# Altium project lightSoakV1.PrjPcb (part 1 of 2)
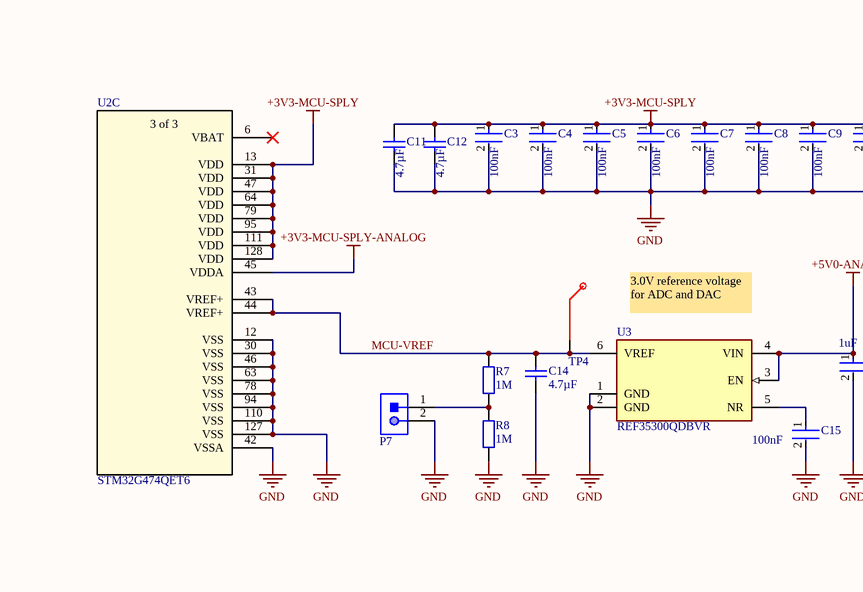
[diagram p0: V1_sch.SchDoc, top left]
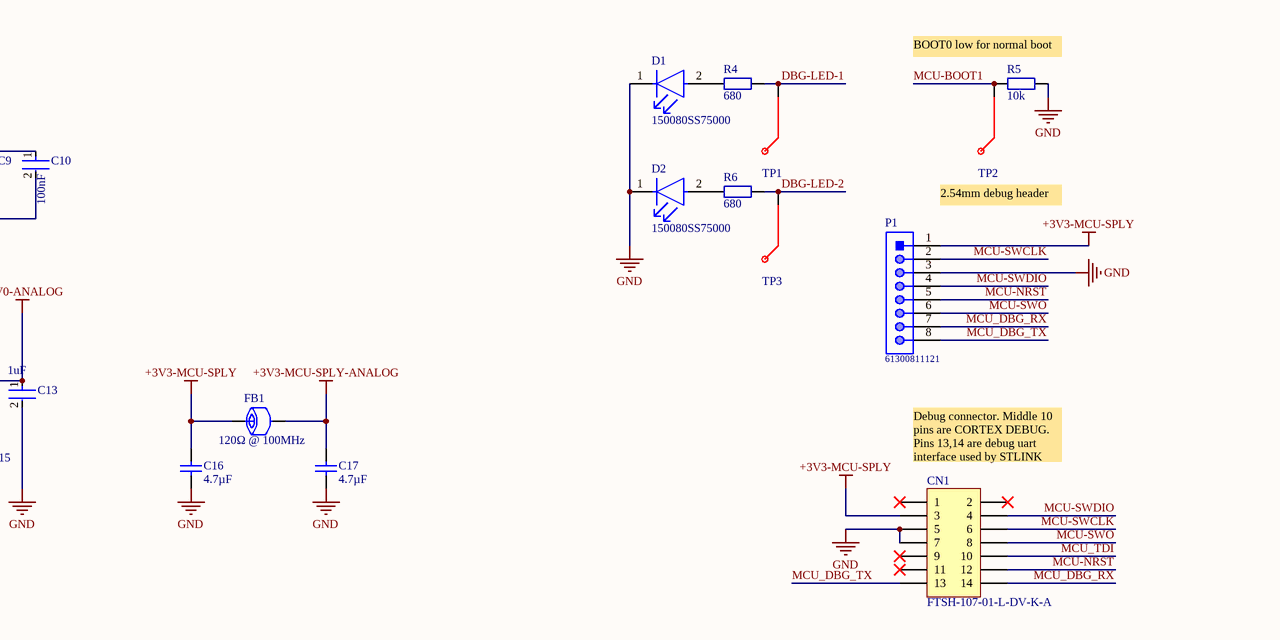
[diagram p1: V1_sch.SchDoc, top right]
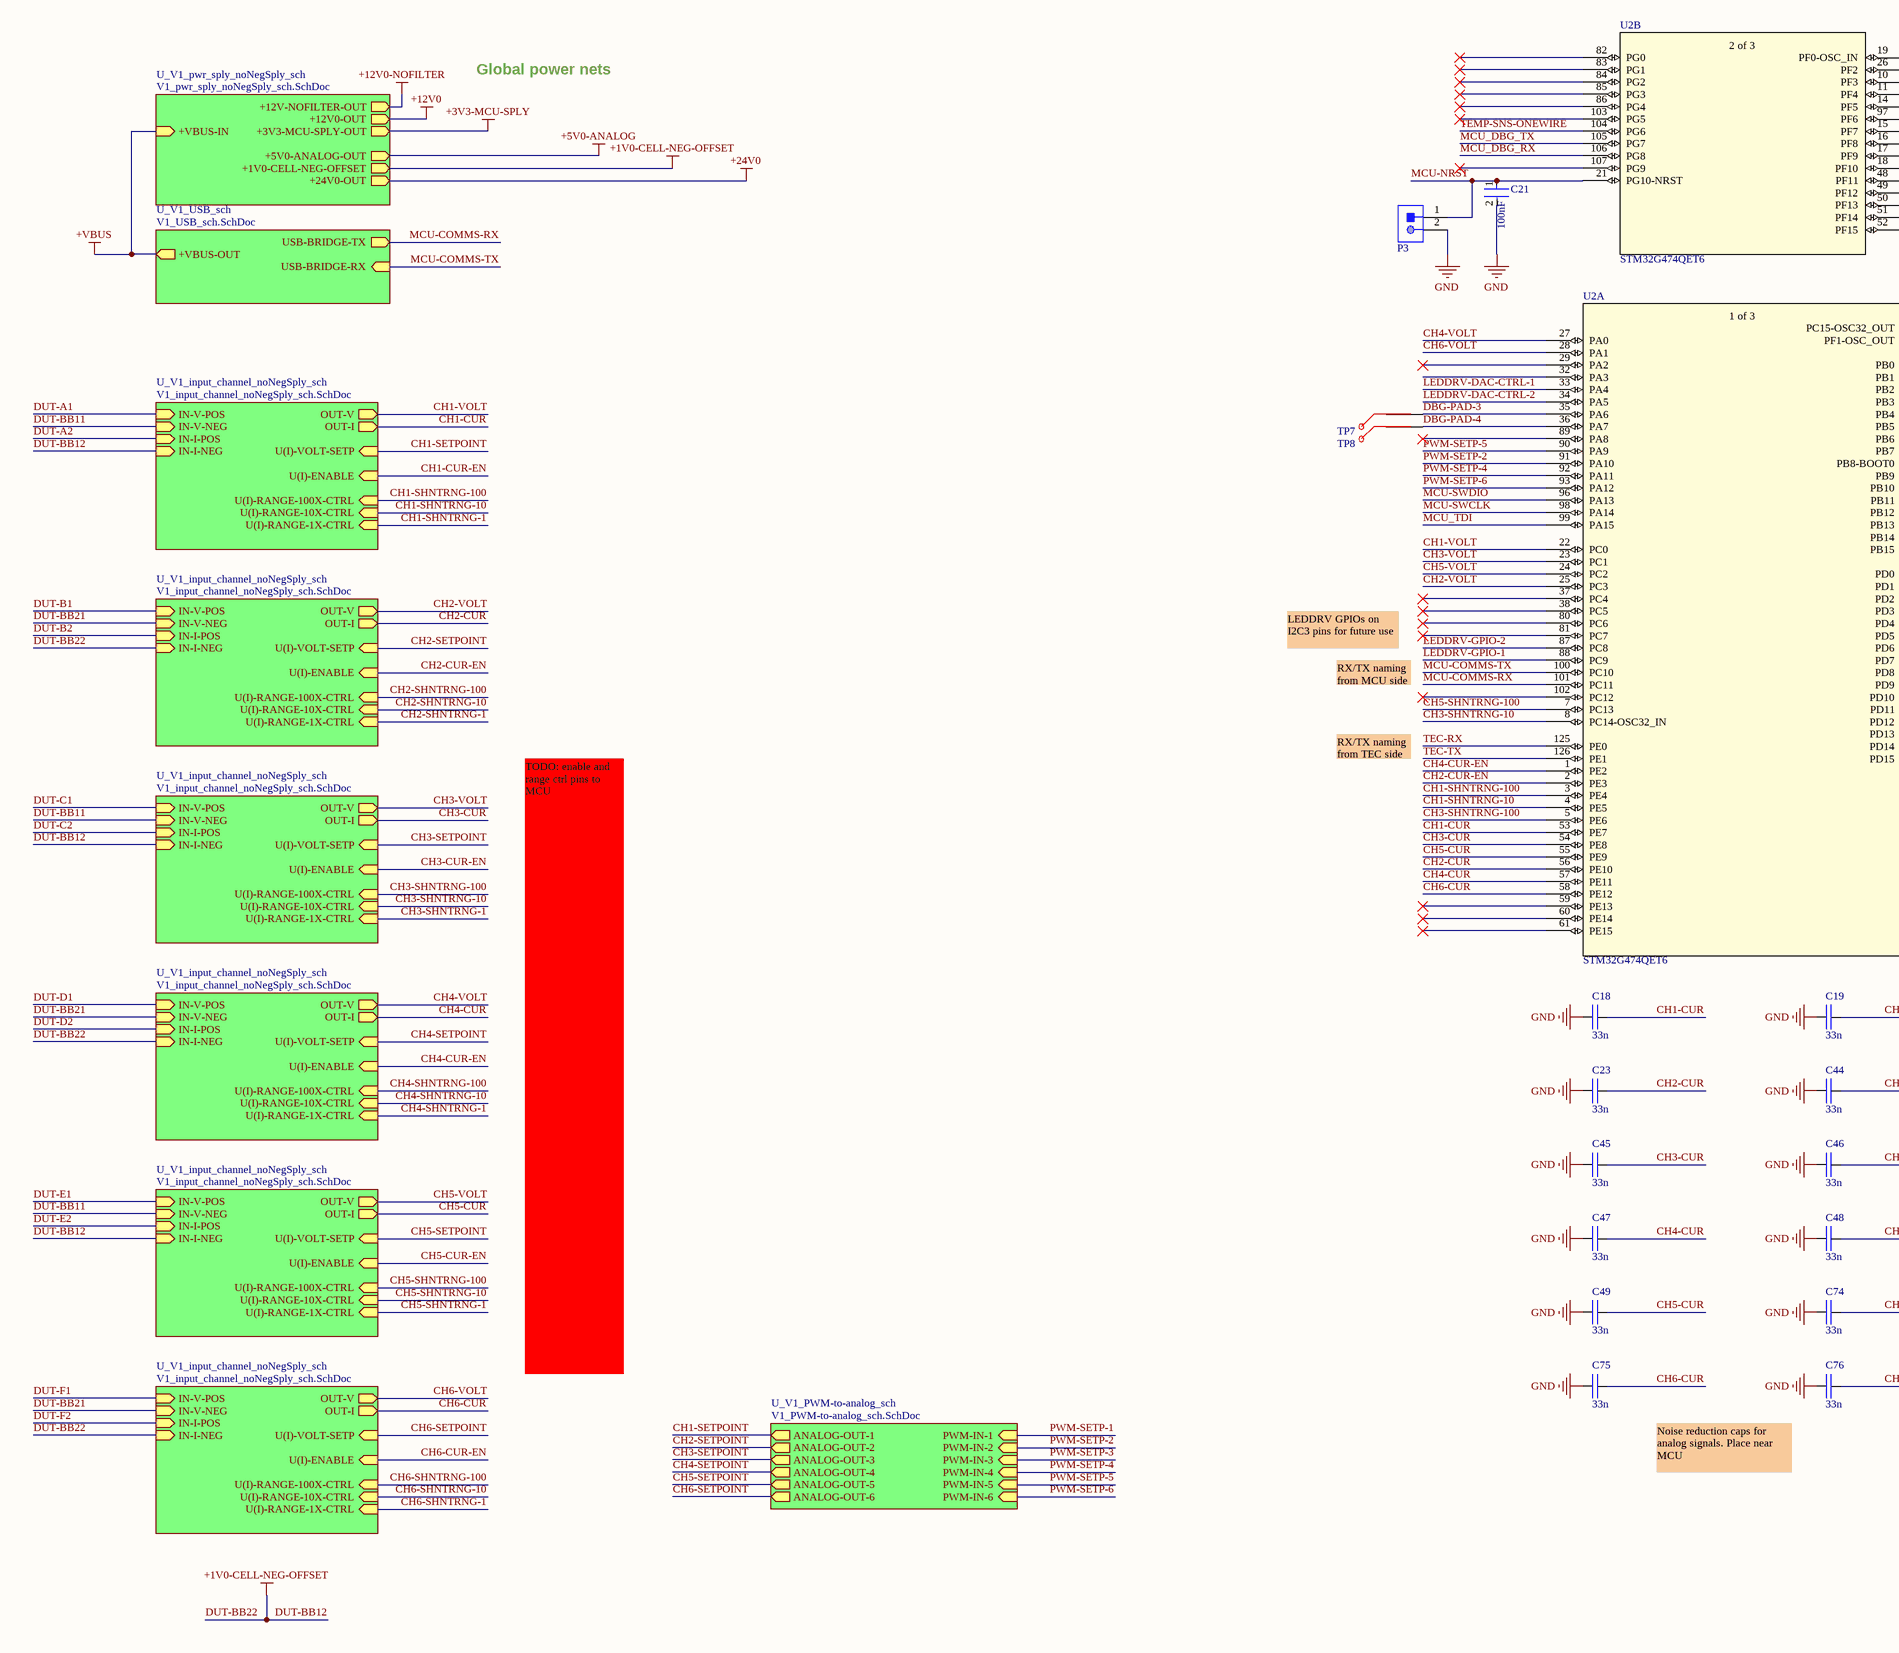
[diagram p2: V1_sch.SchDoc, bottom left]
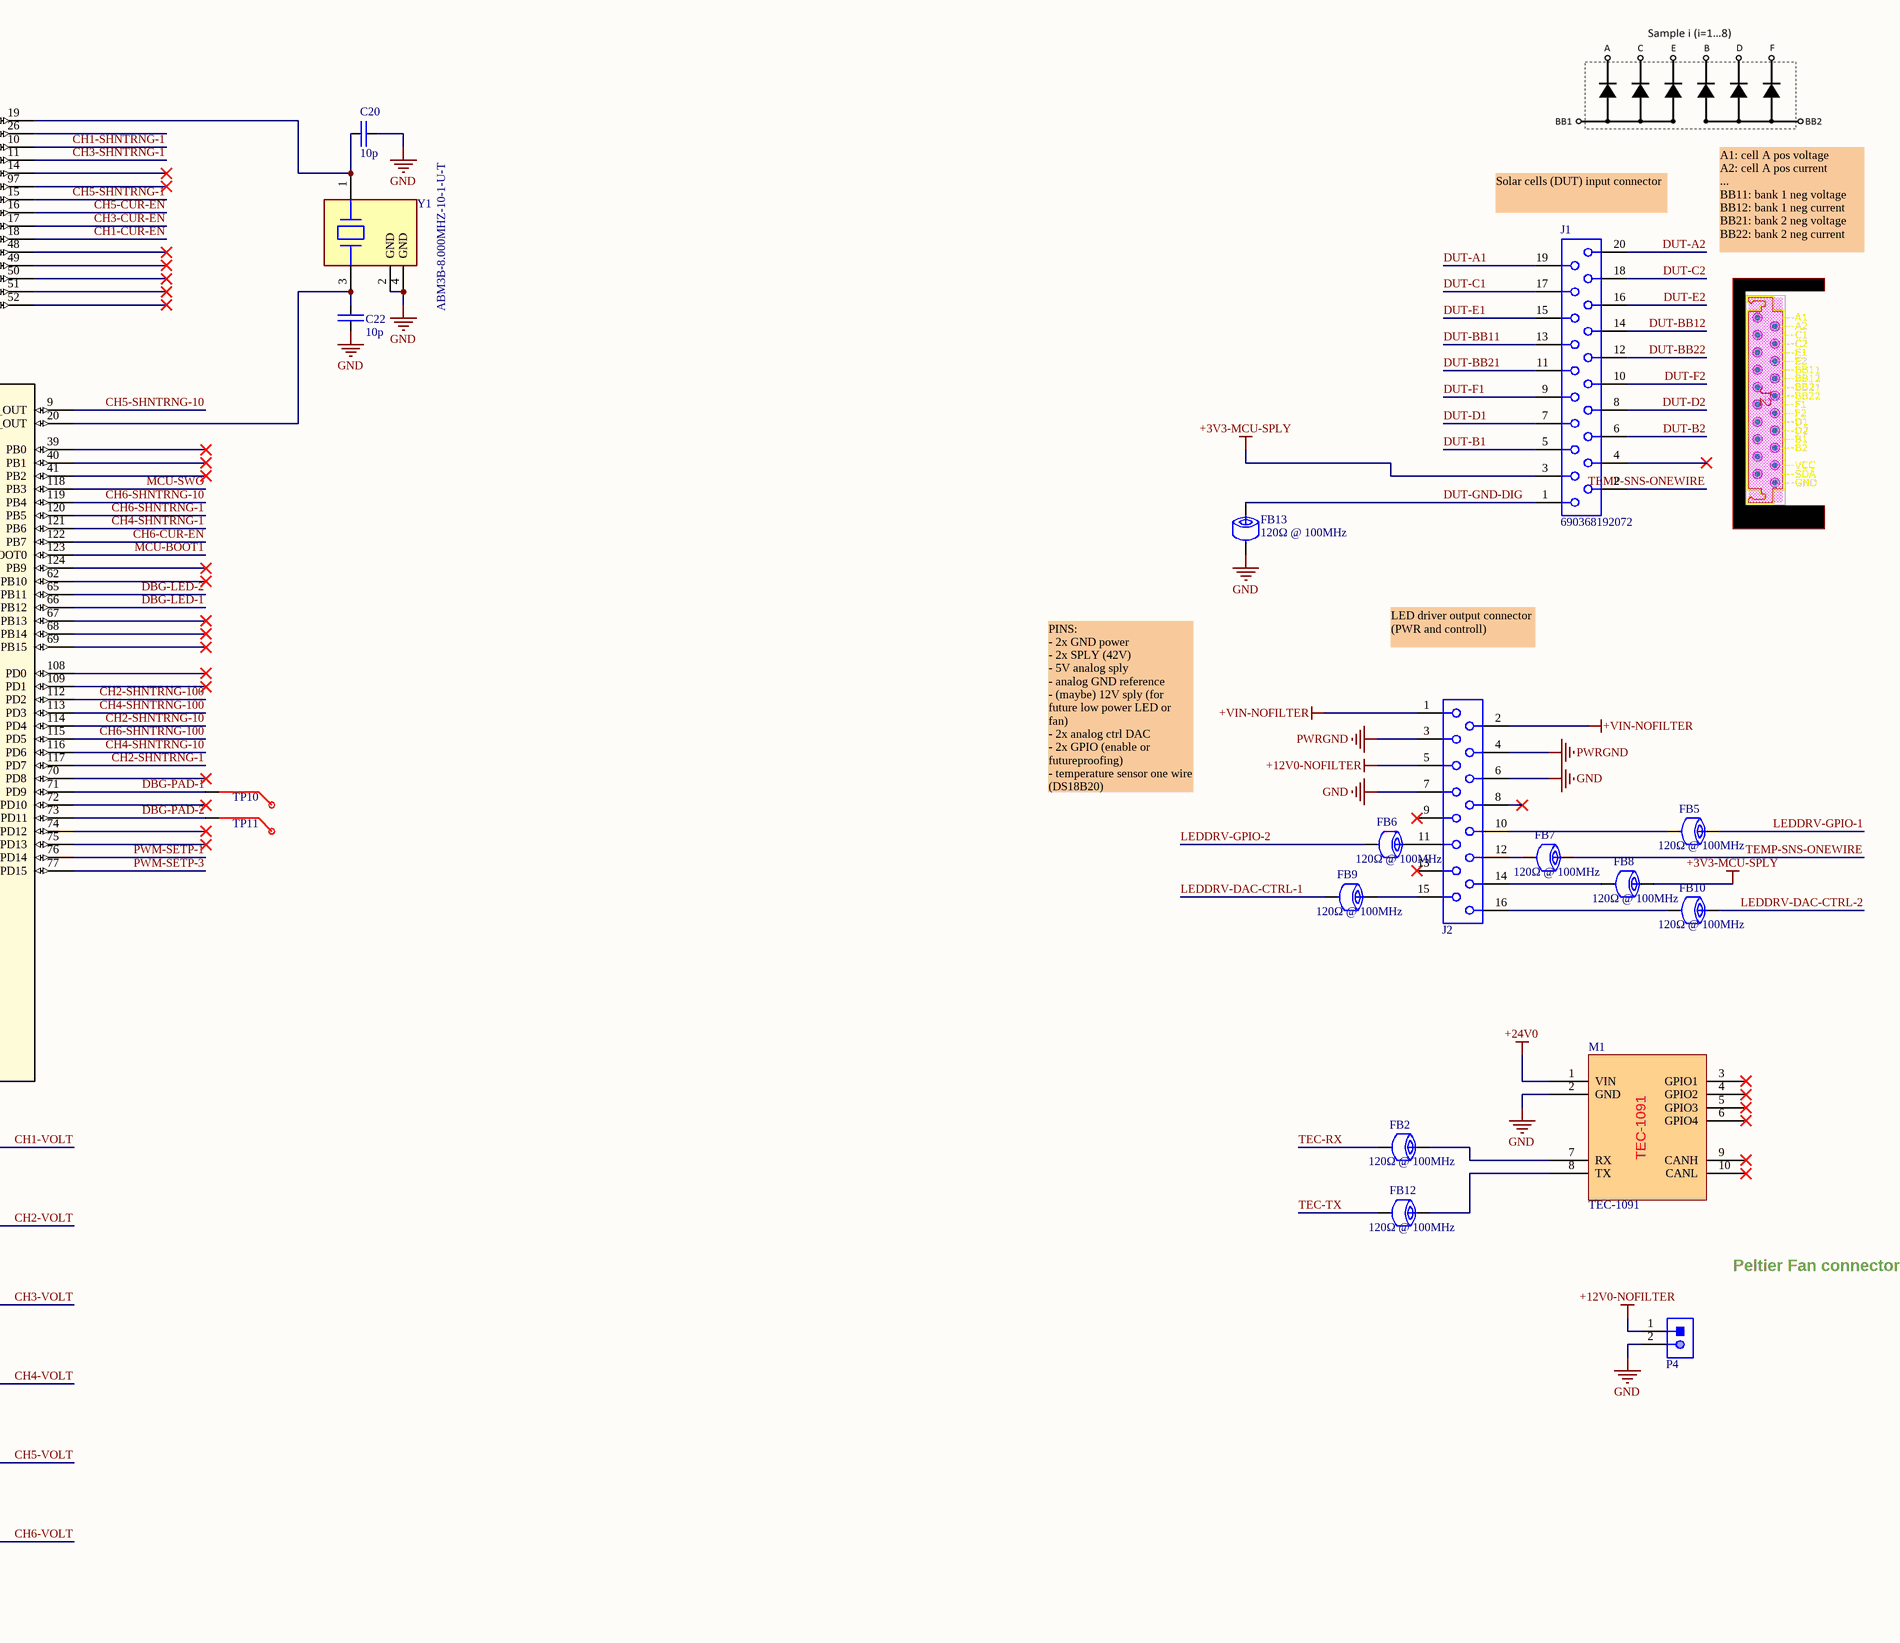
[diagram p3: V1_sch.SchDoc, bottom right]
5 sheets, 451 parts. Net scope: hierarchical (ports join the sheet entries above them; power ports are global).
Board file: V1_PCB-main.PcbDoc
Sheets:
  V1_sch.SchDoc
    U_V1_pwr_sply_noNegSply_sch = V1_pwr_sply_noNegSply_sch.SchDoc
    U_V1_USB_sch = V1_USB_sch.SchDoc
    U_V1_input_channel_noNegSply_sch = V1_input_channel_noNegSply_sch.SchDoc
    U_V1_input_channel_noNegSply_sch = V1_input_channel_noNegSply_sch.SchDoc
    U_V1_input_channel_noNegSply_sch = V1_input_channel_noNegSply_sch.SchDoc
    U_V1_input_channel_noNegSply_sch = V1_input_channel_noNegSply_sch.SchDoc
    U_V1_input_channel_noNegSply_sch = V1_input_channel_noNegSply_sch.SchDoc
    U_V1_input_channel_noNegSply_sch = V1_input_channel_noNegSply_sch.SchDoc
    U_V1_PWM-to-analog_sch = V1_PWM-to-analog_sch.SchDoc

## Sheet V1_sch.SchDoc
size A1; SheetNumber: 1; SheetTotal: 5; SPICEModelCacheQUSBBUGH: <root> / <DocumentId>QUSBBUGH</DocumentId> / <CacheFrame Number="0"> / <Model Name="0805_885012107018_4.7uf" Kind="CKT"> / <Text>******* / .subckt 0805_885012107018_4.7uF 1 2 / Rser 1 3 0.00349429730952 / Lser 2 4 2.52123218E-10 / C1 3 4 0.0000047 / Rpar 3 4 20000000 / .ends 0805_885012107018_4.7uF</Text> / </Model> / </CacheFrame> / </root>

### Parts
C3  Capacitance: 100nF  [FP-885012206095-IPC_B]  (hidden comment: 885012206095)
C4  Capacitance: 100nF  [FP-885012206095-IPC_B]  (hidden comment: 885012206095)
C5  Capacitance: 100nF  [FP-885012206095-IPC_B]  (hidden comment: 885012206095)
C6  Capacitance: 100nF  [FP-885012206095-IPC_B]  (hidden comment: 885012206095)
C7  Capacitance: 100nF  [FP-885012206095-IPC_B]  (hidden comment: 885012206095)
C8  Capacitance: 100nF  [FP-885012206095-IPC_B]  (hidden comment: 885012206095)
C9  Capacitance: 100nF  [FP-885012206095-IPC_B]  (hidden comment: 885012206095)
C10  Capacitance: 100nF  [FP-885012206095-IPC_B]  (hidden comment: 885012206095)
C11  Capacitance: 4.7µF  [WCAP-CSGP_0805_L2W1.25H1.25]  (hidden comment: 885012107018)
C12  Capacitance: 4.7µF  [WCAP-CSGP_0805_L2W1.25H1.25]  (hidden comment: 885012107018)
C13  Capacitance: 1uF  [FP-885012207078-IPC_B]  (hidden comment: 885012207078)
C14  Capacitance: 4.7µF  [WCAP-CSGP_0805_L2W1.25H1.25]  (hidden comment: 885012107018)
C15  Capacitance: 100nF  [FP-885012206095-IPC_B]  (hidden comment: 885012206095)
C16  Capacitance: 4.7µF  [WCAP-CSGP_0805_L2W1.25H1.25]  (hidden comment: 885012107018)
C17  Capacitance: 4.7µF  [WCAP-CSGP_0805_L2W1.25H1.25]  (hidden comment: 885012107018)
C18  value 33n  [FPR_0603_C_R0]  (hidden comment: PN_C0603_TBD)
C19  value 33n  [FPR_0603_C_R0]  (hidden comment: PN_C0603_TBD)
C20  value 10p  [FPR_0603_C_R0]  (hidden comment: PN_C0603_10p)
C21  Capacitance: 100nF  [FP-885012206095-IPC_B]  (hidden comment: 885012206095)
C22  value 10p  [FPR_0603_C_R0]  (hidden comment: PN_C0603_10p)
C23  value 33n  [FPR_0603_C_R0]  (hidden comment: PN_C0603_TBD)
C44  value 33n  [FPR_0603_C_R0]  (hidden comment: PN_C0603_TBD)
C45  value 33n  [FPR_0603_C_R0]  (hidden comment: PN_C0603_TBD)
C46  value 33n  [FPR_0603_C_R0]  (hidden comment: PN_C0603_TBD)
C47  value 33n  [FPR_0603_C_R0]  (hidden comment: PN_C0603_TBD)
C48  value 33n  [FPR_0603_C_R0]  (hidden comment: PN_C0603_TBD)
C49  value 33n  [FPR_0603_C_R0]  (hidden comment: PN_C0603_TBD)
C74  value 33n  [FPR_0603_C_R0]  (hidden comment: PN_C0603_TBD)
C75  value 33n  [FPR_0603_C_R0]  (hidden comment: PN_C0603_TBD)
C76  value 33n  [FPR_0603_C_R0]  (hidden comment: PN_C0603_TBD)
CN1  FTSH-107-01-L-DV-K-A  [CON_STDC14_Receiver_MEDIUM_WITH_MIPI10_3D]
D1  150080SS75000  [FP-150080SS75000-MFG]
D2  150080SS75000  [FP-150080SS75000-MFG]
FB1  120Ω @ 100MHz  [SMD_0805]
FB2  120Ω @ 100MHz  [SMD_0805]
FB5  120Ω @ 100MHz  [SMD_0805]
FB6  120Ω @ 100MHz  [SMD_0805]
FB7  120Ω @ 100MHz  [SMD_0805]
FB8  120Ω @ 100MHz  [SMD_0805]
FB9  120Ω @ 100MHz  [SMD_0805]
FB10  120Ω @ 100MHz  [SMD_0805]
FB12  120Ω @ 100MHz  [SMD_0805]
FB13  120Ω @ 100MHz  [SMD_0805]
J1  690368192072  [690368192072]
J2  690368191672  [690368191672]  (value not drawn)
M1  TEC-1091  [tec1091-pins]
P1  61300811121  [61300811121]
P3  61300211121  [61300211121]  (value not drawn)
P4  61300211121  [61300211121]  (value not drawn)
P7  61300211121  [61300211121]  (value not drawn)
R4  value 680  [FPR_0603_R_R0]  (hidden comment: PN_R0603_680R)
R5  value 10k  [FPR_0603_R_R0]  (hidden comment: PN_R0603_10k)
R6  value 680  [FPR_0603_R_R0]  (hidden comment: PN_R0603_680R)
R7  value 1M  [FPR_0603_R_R0]  (hidden comment: PN_R0603_1M)
R8  value 1M  [FPR_0603_R_R0]  (hidden comment: PN_R0603_1M)
TP1  Test Point  [Test Point 1.5mm SMD]  (value not drawn)
TP2  Test Point  [Test Point 1.5mm SMD]  (value not drawn)
TP3  Test Point  [Test Point 1.5mm SMD]  (value not drawn)
TP4  Test Point  [Test Point 1.5mm SMD]  (value not drawn)
TP7  Test Point  [Test Point 1.5mm SMD]  (value not drawn)
TP8  Test Point  [Test Point 1.5mm SMD]  (value not drawn)
TP10  Test Point  [Test Point 1.5mm SMD]  (value not drawn)
TP11  Test Point  [Test Point 1.5mm SMD]  (value not drawn)
U2  STM32G474QET6  [LPQFP-128]  (parts A,B,C of 3)
U3  REF35300QDBVR  [FP-DBV0006A-MFG]
Y1  ABM3B-8.000MHZ-10-1-U-T  [FP-ABM3B-MFG]

### Sub-sheets
U_V1_input_channel_noNegSply_sch = V1_input_channel_noNegSply_sch.SchDoc: OUT-V (out), IN-V-POS (in), IN-V-NEG (in), IN-I-POS (in), U(I)-ENABLE (in), U(I)-VOLT-SETP (in), U(I)-RANGE-100X-CTRL (in), U(I)-RANGE-10X-CTRL (in), U(I)-RANGE-1X-CTRL (in), OUT-I (out), IN-I-NEG (in)
U_V1_input_channel_noNegSply_sch = V1_input_channel_noNegSply_sch.SchDoc: OUT-V (out), IN-V-POS (in), IN-V-NEG (in), IN-I-NEG (in), IN-I-POS (in), U(I)-ENABLE (in), U(I)-VOLT-SETP (in), U(I)-RANGE-100X-CTRL (in), U(I)-RANGE-10X-CTRL (in), U(I)-RANGE-1X-CTRL (in), OUT-I (out)
U_V1_input_channel_noNegSply_sch = V1_input_channel_noNegSply_sch.SchDoc: OUT-V (out), IN-V-POS (in), IN-V-NEG (in), IN-I-NEG (in), IN-I-POS (in), U(I)-ENABLE (in), U(I)-VOLT-SETP (in), U(I)-RANGE-100X-CTRL (in), U(I)-RANGE-10X-CTRL (in), U(I)-RANGE-1X-CTRL (in), OUT-I (out)
U_V1_input_channel_noNegSply_sch = V1_input_channel_noNegSply_sch.SchDoc: OUT-V (out), IN-V-POS (in), IN-V-NEG (in), IN-I-NEG (in), IN-I-POS (in), U(I)-ENABLE (in), U(I)-VOLT-SETP (in), U(I)-RANGE-100X-CTRL (in), U(I)-RANGE-10X-CTRL (in), U(I)-RANGE-1X-CTRL (in), OUT-I (out)
U_V1_input_channel_noNegSply_sch = V1_input_channel_noNegSply_sch.SchDoc: OUT-V (out), IN-V-POS (in), IN-V-NEG (in), IN-I-NEG (in), IN-I-POS (in), U(I)-ENABLE (in), U(I)-VOLT-SETP (in), U(I)-RANGE-100X-CTRL (in), U(I)-RANGE-10X-CTRL (in), U(I)-RANGE-1X-CTRL (in), OUT-I (out)
U_V1_input_channel_noNegSply_sch = V1_input_channel_noNegSply_sch.SchDoc: OUT-V (out), IN-V-POS (in), IN-V-NEG (in), IN-I-NEG (in), IN-I-POS (in), U(I)-ENABLE (in), U(I)-VOLT-SETP (in), U(I)-RANGE-100X-CTRL (in), U(I)-RANGE-10X-CTRL (in), U(I)-RANGE-1X-CTRL (in), OUT-I (out)
U_V1_PWM-to-analog_sch = V1_PWM-to-analog_sch.SchDoc: PWM-IN-1 (in), PWM-IN-2 (in), PWM-IN-3 (in), PWM-IN-4 (in), PWM-IN-5 (in), PWM-IN-6 (in), ANALOG-OUT-1 (out), ANALOG-OUT-2 (out), ANALOG-OUT-3 (out), ANALOG-OUT-4 (out), ANALOG-OUT-5 (out), ANALOG-OUT-6 (out)
U_V1_pwr_sply_noNegSply_sch = V1_pwr_sply_noNegSply_sch.SchDoc: +12V-NOFILTER-OUT (out), +12V0-OUT (out), +3V3-MCU-SPLY-OUT (out), +5V0-ANALOG-OUT (out), +VBUS-IN (in), +1V0-CELL-NEG-OFFSET (out), +24V0-OUT (out)
U_V1_USB_sch = V1_USB_sch.SchDoc: USB-BRIDGE-TX (out), USB-BRIDGE-RX (in), +VBUS-OUT (out)

### Nets
+3V3-MCU-SPLY: C3.1 C4.1 C5.1 C6.1 C7.1 C8.1 C9.1 C10.1 C11.2 C12.2 C16.2 CN1.3 FB1.1 FB8.1 J1.3 P1.1 U2.13(VDD) U2.31(VDD) U2.47(VDD) U2.64(VDD) U2.79(VDD) U2.95(VDD) U2.111(VDD) U2.128(VDD) ; sheet U_V1_pwr_sply_noNegSply_sch/+3V3-MCU-SPLY-OUT
+3V3-MCU-SPLY-ANALOG: C17.2 FB1.2 U2.45(VDDA)
+5V0-ANALOG: C13.1 U3.3(EN) U3.4(VIN) ; sheet U_V1_pwr_sply_noNegSply_sch/+5V0-ANALOG-OUT
+12V0-NOFILTER: J2.5 P4.1 ; sheet U_V1_pwr_sply_noNegSply_sch/+12V-NOFILTER-OUT  [project net +12V-NOFILTER]
+24V0: M1.1(VIN) ; sheet U_V1_pwr_sply_noNegSply_sch/+24V0-OUT
+VBUS: sheet U_V1_pwr_sply_noNegSply_sch/+VBUS-IN, sheet U_V1_USB_sch/+VBUS-OUT
+VIN-NOFILTER: J2.1 J2.2
DUT-BB12: J1.12 J1.14 ; sheet U_V1_pwr_sply_noNegSply_sch/+1V0-CELL-NEG-OFFSET, sheet U_V1_input_channel_noNegSply_sch/IN-I-NEG, sheet U_V1_input_channel_noNegSply_sch/IN-I-NEG, sheet U_V1_input_channel_noNegSply_sch/IN-I-NEG, sheet U_V1_input_channel_noNegSply_sch/IN-I-NEG, sheet U_V1_input_channel_noNegSply_sch/IN-I-NEG, sheet U_V1_input_channel_noNegSply_sch/IN-I-NEG  [also labelled +1V0-CELL-NEG-OFFSET, DUT-BB22]
GND: C3.2 C4.2 C5.2 C6.2 C7.2 C8.2 C9.2 C10.2 C11.1 C12.1 C13.2 C14.1 C15.2 C16.1 C17.1 C18.2 C19.2 C20.2 C21.2 C22.2 C23.2 C44.2 C45.2 C46.2 C47.2 C48.2 C49.2 C74.2 C75.2 C76.2 CN1.5 CN1.7 D1.1(C) D2.1(C) FB13.2 J2.6 J2.7 M1.2(GND) P1.3 P3.2 P4.2 P7.2 R5.1 R8.2 U2.12(VSS) U2.30(VSS) U2.42(VSSA) U2.46(VSS) U2.63(VSS) U2.78(VSS) U2.94(VSS) U2.110(VSS) U2.127(VSS) U3.1(GND) U3.2(GND) Y1.2(GND) Y1.4(GND)
PWRGND: J2.3 J2.4
CH1-CUR: C18.1 U2.53(PE7) ; sheet U_V1_input_channel_noNegSply_sch/OUT-I
CH1-CUR-EN: U2.18(PF10) ; sheet U_V1_input_channel_noNegSply_sch/U(I)-ENABLE
CH1-SETPOINT: sheet U_V1_input_channel_noNegSply_sch/U(I)-VOLT-SETP, sheet U_V1_PWM-to-analog_sch/ANALOG-OUT-1
CH1-SHNTRNG-1: U2.10(PF3) ; sheet U_V1_input_channel_noNegSply_sch/U(I)-RANGE-1X-CTRL
CH1-SHNTRNG-10: U2.4(PE5) ; sheet U_V1_input_channel_noNegSply_sch/U(I)-RANGE-10X-CTRL
CH1-SHNTRNG-100: U2.3(PE4) ; sheet U_V1_input_channel_noNegSply_sch/U(I)-RANGE-100X-CTRL
CH1-VOLT: C19.1 U2.22(PC0) ; sheet U_V1_input_channel_noNegSply_sch/OUT-V
CH2-CUR: C23.1 U2.56(PE10) ; sheet U_V1_input_channel_noNegSply_sch/OUT-I
CH2-CUR-EN: U2.2(PE3) ; sheet U_V1_input_channel_noNegSply_sch/U(I)-ENABLE
CH2-SETPOINT: sheet U_V1_input_channel_noNegSply_sch/U(I)-VOLT-SETP, sheet U_V1_PWM-to-analog_sch/ANALOG-OUT-2
CH2-SHNTRNG-1: U2.117(PD7) ; sheet U_V1_input_channel_noNegSply_sch/U(I)-RANGE-1X-CTRL
CH2-SHNTRNG-10: U2.114(PD4) ; sheet U_V1_input_channel_noNegSply_sch/U(I)-RANGE-10X-CTRL
CH2-SHNTRNG-100: U2.112(PD2) ; sheet U_V1_input_channel_noNegSply_sch/U(I)-RANGE-100X-CTRL
CH2-VOLT: C44.1 U2.25(PC3) ; sheet U_V1_input_channel_noNegSply_sch/OUT-V
CH3-CUR: C45.1 U2.54(PE8) ; sheet U_V1_input_channel_noNegSply_sch/OUT-I
CH3-CUR-EN: U2.17(PF9) ; sheet U_V1_input_channel_noNegSply_sch/U(I)-ENABLE
CH3-SETPOINT: sheet U_V1_input_channel_noNegSply_sch/U(I)-VOLT-SETP, sheet U_V1_PWM-to-analog_sch/ANALOG-OUT-3
CH3-SHNTRNG-1: U2.11(PF4) ; sheet U_V1_input_channel_noNegSply_sch/U(I)-RANGE-1X-CTRL
CH3-SHNTRNG-10: U2.8(PC14-OSC32_IN) ; sheet U_V1_input_channel_noNegSply_sch/U(I)-RANGE-10X-CTRL
CH3-SHNTRNG-100: U2.5(PE6) ; sheet U_V1_input_channel_noNegSply_sch/U(I)-RANGE-100X-CTRL
CH3-VOLT: C46.1 U2.23(PC1) ; sheet U_V1_input_channel_noNegSply_sch/OUT-V
CH4-CUR: C47.1 U2.57(PE11) ; sheet U_V1_input_channel_noNegSply_sch/OUT-I
CH4-CUR-EN: U2.1(PE2) ; sheet U_V1_input_channel_noNegSply_sch/U(I)-ENABLE
CH4-SETPOINT: sheet U_V1_input_channel_noNegSply_sch/U(I)-VOLT-SETP, sheet U_V1_PWM-to-analog_sch/ANALOG-OUT-4
CH4-SHNTRNG-1: U2.121(PB6) ; sheet U_V1_input_channel_noNegSply_sch/U(I)-RANGE-1X-CTRL
CH4-SHNTRNG-10: U2.116(PD6) ; sheet U_V1_input_channel_noNegSply_sch/U(I)-RANGE-10X-CTRL
CH4-SHNTRNG-100: U2.113(PD3) ; sheet U_V1_input_channel_noNegSply_sch/U(I)-RANGE-100X-CTRL
CH4-VOLT: C48.1 U2.27(PA0) ; sheet U_V1_input_channel_noNegSply_sch/OUT-V
CH5-CUR: C49.1 U2.55(PE9) ; sheet U_V1_input_channel_noNegSply_sch/OUT-I
CH5-CUR-EN: U2.16(PF8) ; sheet U_V1_input_channel_noNegSply_sch/U(I)-ENABLE
CH5-SETPOINT: sheet U_V1_input_channel_noNegSply_sch/U(I)-VOLT-SETP, sheet U_V1_PWM-to-analog_sch/ANALOG-OUT-5
CH5-SHNTRNG-1: U2.15(PF7) ; sheet U_V1_input_channel_noNegSply_sch/U(I)-RANGE-1X-CTRL
CH5-SHNTRNG-10: U2.9(PC15-OSC32_OUT) ; sheet U_V1_input_channel_noNegSply_sch/U(I)-RANGE-10X-CTRL
CH5-SHNTRNG-100: U2.7(PC13) ; sheet U_V1_input_channel_noNegSply_sch/U(I)-RANGE-100X-CTRL
CH5-VOLT: C74.1 U2.24(PC2) ; sheet U_V1_input_channel_noNegSply_sch/OUT-V
CH6-CUR: C75.1 U2.58(PE12) ; sheet U_V1_input_channel_noNegSply_sch/OUT-I
CH6-CUR-EN: U2.122(PB7) ; sheet U_V1_input_channel_noNegSply_sch/U(I)-ENABLE
CH6-SETPOINT: sheet U_V1_input_channel_noNegSply_sch/U(I)-VOLT-SETP, sheet U_V1_PWM-to-analog_sch/ANALOG-OUT-6
CH6-SHNTRNG-1: U2.120(PB5) ; sheet U_V1_input_channel_noNegSply_sch/U(I)-RANGE-1X-CTRL
CH6-SHNTRNG-10: U2.119(PB4) ; sheet U_V1_input_channel_noNegSply_sch/U(I)-RANGE-10X-CTRL
CH6-SHNTRNG-100: U2.115(PD5) ; sheet U_V1_input_channel_noNegSply_sch/U(I)-RANGE-100X-CTRL
CH6-VOLT: C76.1 U2.28(PA1) ; sheet U_V1_input_channel_noNegSply_sch/OUT-V
DBG-LED-1: R4.1 TP1.1 U2.66(PB12)
DBG-LED-2: R6.1 TP3.1 U2.65(PB11)
DBG-PAD-1: TP10.1 U2.71(PD9)
DBG-PAD-2: TP11.1 U2.73(PD11)
DBG-PAD-3: TP7.1 U2.35(PA6)
DBG-PAD-4: TP8.1 U2.36(PA7)
DUT-A1: J1.19 ; sheet U_V1_input_channel_noNegSply_sch/IN-V-POS
DUT-A2: J1.20 ; sheet U_V1_input_channel_noNegSply_sch/IN-I-POS
DUT-B1: J1.5 ; sheet U_V1_input_channel_noNegSply_sch/IN-V-POS
DUT-B2: J1.6 ; sheet U_V1_input_channel_noNegSply_sch/IN-I-POS
DUT-BB11: J1.13 ; sheet U_V1_input_channel_noNegSply_sch/IN-V-NEG, sheet U_V1_input_channel_noNegSply_sch/IN-V-NEG, sheet U_V1_input_channel_noNegSply_sch/IN-V-NEG
DUT-BB21: J1.11 ; sheet U_V1_input_channel_noNegSply_sch/IN-V-NEG, sheet U_V1_input_channel_noNegSply_sch/IN-V-NEG, sheet U_V1_input_channel_noNegSply_sch/IN-V-NEG
DUT-C1: J1.17 ; sheet U_V1_input_channel_noNegSply_sch/IN-V-POS
DUT-C2: J1.18 ; sheet U_V1_input_channel_noNegSply_sch/IN-I-POS
DUT-D1: J1.7 ; sheet U_V1_input_channel_noNegSply_sch/IN-V-POS
DUT-D2: J1.8 ; sheet U_V1_input_channel_noNegSply_sch/IN-I-POS
DUT-E1: J1.15 ; sheet U_V1_input_channel_noNegSply_sch/IN-V-POS
DUT-E2: J1.16 ; sheet U_V1_input_channel_noNegSply_sch/IN-I-POS
DUT-F1: J1.9 ; sheet U_V1_input_channel_noNegSply_sch/IN-V-POS
DUT-F2: J1.10 ; sheet U_V1_input_channel_noNegSply_sch/IN-I-POS
DUT-GND-DIG: FB13.1 J1.1
LEDDRV-DAC-CTRL-1: FB9.2 U2.33(PA4)
LEDDRV-DAC-CTRL-2: FB10.1 U2.34(PA5)
LEDDRV-GPIO-1: FB5.1 U2.88(PC9)
LEDDRV-GPIO-2: FB6.2 U2.87(PC8)
MCU-BOOT1: R5.2 TP2.1 U2.123(PB8-BOOT0)
MCU-COMMS-RX: U2.101(PC11) ; sheet U_V1_USB_sch/USB-BRIDGE-TX
MCU-COMMS-TX: U2.100(PC10) ; sheet U_V1_USB_sch/USB-BRIDGE-RX
MCU-NRST: C21.1 CN1.12 P1.5 P3.1 U2.21(PG10-NRST)
MCU-SWCLK: CN1.6 P1.2 U2.98(PA14)
MCU-SWDIO: CN1.4 P1.4 U2.96(PA13)
MCU-SWO: CN1.8 P1.6 U2.118(PB3)
MCU-VREF: C14.2 R7.1 TP4.1 U2.43(VREF+) U2.44(VREF+) U3.6(VREF)
MCU_DBG_RX: CN1.14 P1.7 U2.106(PG8)
MCU_DBG_TX: CN1.13 P1.8 U2.105(PG7)
MCU_TDI: CN1.10 U2.99(PA15)
PWM-SETP-1: U2.76(PD14) ; sheet U_V1_PWM-to-analog_sch/PWM-IN-1
PWM-SETP-2: U2.91(PA10) ; sheet U_V1_PWM-to-analog_sch/PWM-IN-2
PWM-SETP-3: U2.77(PD15) ; sheet U_V1_PWM-to-analog_sch/PWM-IN-3
PWM-SETP-4: U2.92(PA11) ; sheet U_V1_PWM-to-analog_sch/PWM-IN-4
PWM-SETP-5: U2.90(PA9) ; sheet U_V1_PWM-to-analog_sch/PWM-IN-5
PWM-SETP-6: U2.93(PA12) ; sheet U_V1_PWM-to-analog_sch/PWM-IN-6
TEC-RX: FB2.2 U2.125(PE0)
TEC-TX: FB12.2 U2.126(PE1)
TEMP-SNS-ONEWIRE: FB7.1 J1.2 U2.104(PG6)
NetC15_1: C15.1 U3.5(NR)
NetC20_1: C20.1 U2.19(PF0-OSC_IN) Y1.1
NetC22_1: C22.1 U2.20(PF1-OSC_OUT) Y1.3
NetD1_2: D1.2(A) R4.2
NetD2_2: D2.2(A) R6.2
NetFB2_1: FB2.1 M1.7(RX)
NetFB5_2: FB5.2 J2.10
NetFB6_1: FB6.1 J2.11
NetFB7_2: FB7.2 J2.12
NetFB8_2: FB8.2 J2.14
NetFB9_1: FB9.1 J2.15
NetFB10_2: FB10.2 J2.16
NetFB12_1: FB12.1 M1.8(TX)
NetP7_1: P7.1 R7.2 R8.1

Not connected (* = marked no-connect by the designer): CN1 1* 2* 9* 11*; J1 4*; J2 8* 9* 13*; M1 3(GPIO1)* 4(GPIO2)* 5(GPIO3)* 6(GPIO4)* 9(CANH)* 10(CANL)*; U2 6(VBAT)* 14(PF5)* 26(PF2) 29(PA2)* 32(PA3) 37(PC4)* 38(PC5)* 39(PB0)* 40(PB1)* 41(PB2)* 48(PF11)* 49(PF12)* 50(PF13)* 51(PF14)* 52(PF15)* 59(PE13)* 60(PE14)* 61(PE15)* 62(PB10)* 67(PB13)* 68(PB14)* 69(PB15)* 70(PD8)* 72(PD10)* 74(PD12)* 75(PD13)* 80(PC6)* 81(PC7)* 82(PG0)* 83(PG1)* 84(PG2)* 85(PG3)* 86(PG4)* 89(PA8)* 97(PF6)* 102(PC12)* 103(PG5)* 107(PG9)* 108(PD0)* 109(PD1)* 124(PB9)*

### Notes on the sheet
- (near R5) BOOT0 low for normal boot
- 2.54mm debug header
- 3.0V reference voltage for ADC and DAC
- (near CN1) Debug connector. Middle 10 pins are CORTEX DEBUG. Pins 13,14 are debug uart interface used by STLINK devices.
- Global power nets
- (near J1) Solar cells (DUT) input connector
- A1: cell A pos voltage
  A2: cell A pos current
  ...
  BB11: bank 1 neg voltage
  BB12: bank 1 neg current
  BB21: bank 2 neg voltage
  BB22: bank 2 neg current
- LED driver output connector (PWR and controll)
- LEDDRV GPIOs on I2C3 pins for future use
- RX/TX naming from MCU side
- PINS:
  - 2x GND power
  - 2x SPLY (42V)
  - 5V analog sply
  - analog GND reference
  - (maybe) 12V sply (for future low power LED or fan)
  - 2x analog ctrl DAC
  - 2x GPIO (enable or futureproofing)
  - temperature sensor one wire (DS18B20)
- RX/TX naming from TEC side
- Peltier Fan connector
- TODO: enable and range ctrl pins to MCU
- Noise reduction caps for analog signals. Place near MCU
- (in symbol STM32G474QET6, part A) 1 of 3
- (in symbol STM32G474QET6, part B) 2 of 3
- (in symbol STM32G474QET6, part C) 3 of 3

### Library data of the parts
C3-C10 C15 C21 = CMP-207839-000004-1: CAP CER 0.1UF 50V X7R 0603; Tolerance: 10%; RoHS Compliant: Yes; Thickness: 0.037inch; Voltage Rating: 50V; Packaging: Cut Tape; Dielectric: X7R; Series: WCAP-CSGP; Width: 0.031inch; Max Operating Temperature: 125°C; Min Operating Temperature: -55°C; Case/Package: 0603; Case Code (Metric): 1608; Case Code (Imperial): 0603; Length: 0.063inch; Mount: Surface Mount; Voltage Rating (DC): 50V
C11 C12 C14 C16 C17 = 885012107018: WCAP-CSGP Multilayer Ceramic Chip Capacitor, General Purpose, size 0805, X5R, 4.7µF, 25VDC; Manufacturer: Wurth Elektronik; Case/Size Code: 0805; Capacitance Tolerance: +/-20%; Dissipation Factor: 10%; Insulation Resistance: 0.02GΩ; Rated Voltage (DC): 25V; Technical Reference: X5R0805475M025DFCT10000; Manufacturer Part Number: 885012107018; Category: Multilayer Ceramic Chip Capacitors; Match Code: WCAP-CSGP; ComponentLink1Description: Website Link; ComponentLink1URL: https://www.we-online.com/redexpert/article/885012107018?ad; ComponentLink2Description: Datasheet Link; ComponentLink2URL: https://www.we-online.com/redexpert/spec/885012107018?ad; Mount: Surface Mount; Operating Temperature Max: 85°C; Operating Temperature Min: -55°C; Packaging: Tape and Reel; Length: 2mm; Width: 1.25mm; Height: 1.25mm; Ceramic Type: X5R
C13 = CMP-207839-000010-1: CAP CER 1UF 25V X7R 0805; Tolerance: 10%; Series: WCAP-CSGP; Mount: Surface Mount; RoHS Compliant: Yes; Case Code (Metric): 2012; Width: 0.049inch; Thickness: 0.053inch; Dielectric: X7R; Max Operating Temperature: 125°C; Case Code (Imperial): 0805; Case/Package: 0805; Length: 0.079inch; Voltage Rating: 25V; Packaging: Cut Tape; Min Operating Temperature: -55°C; Voltage Rating (DC): 25V
C18-C20 C22 C23 C44-C49 C74-C76 = C: Capacitor - generic SMD
CN1 = FTSH-107-01-L-DV-K-A: Header 7x2, 1.27mm, Dual row, Straight, Surface mount, vertical male connector. 3.05mm lead. Mates with FFSD connector. Footprint compatible with FTSH-107-01-L-DV,-K,-A,-P,-ES (STDC14 MEDIUM)
D1 D2 = CMP-1426-00010-2: LED RED CLEAR 0805 SMD; Forward Voltage: 1.9V; Luminous Intensity: 60mcd; Dominant Wavelength: 630nm; Forward Current: 30mA; Viewing Angle: 140°; Lens Color: Colorless; Test Current: 20mA; Lens Size: 1.25mm; Packaging: Cut Tape; Width: 1.25mm; Case Code (Metric): 2012; Max Operating Temperature: 85°C; RoHS Compliant: Yes; Mount: Surface Mount; Case/Package: 0805; Series: WL-SMCW; Length: 2mm; Case Code (Imperial): 0805; Wavelength: 630nm; Lens Style: Clear; Min Operating Temperature: -40°C; Color: Red; Lens Transparency: Clear; Package Quantity: 1; Height: 0.8mm
FB1 FB2 FB5-FB10 FB12 FB13 = BLM21AG121SN1D: Ferrite Bead, 0805 [2012 Metric], 120 ohm, 800 mA, BLM21A Series, 0.15 ohm, ± 25%; Manufacturer: Murata; Dealer number: 1515617; Dealer: Farnell; DC resistance: 0.15Ω; Max current: 0.2A; Category: ferite beads; Price: 0.082; Manufacturer Number: BLM21AG121SN1D; AC resistance: 120Ω; Frequency: 100MHz; Case: 0805; Technology: SMT; HelpURL: https://www.farnell.com/datasheets/1914683.pdf
J1 = 690368192072: WR-MM Mini Module Connector, Female, THT, with Latch & Polarization, Angled, pitch 2.54mm, 20p; Manufacturer: Wurth Elektronik; Insulation Resistance: 1000MΩ; Rated Current: 1.5A; Working Voltage: 250VAC; Withstanding Voltage: 500VAC; Contact Resistance: 10mΩ; ComponentLink1Description: Website Link; ComponentLink1URL: https://www.we-online.com/redexpert/article/690368192072?ad; ComponentLink2Description: Datasheet Link; ComponentLink2URL: https://www.we-online.com/redexpert/spec/690368192072?ad; Manufacturer Part Number: 690368192072; Pitch: 2.54mm; Packaging: Tube; Gender: Female; Length: 30mm; Category: Board-to-Board Connectors; Match Code: WR-MM; Mount: Through Hole; Operating Temperature Max: 105°C; Operating Temperature Min: -40°C; Number of Pins: 20; Orientation: Angled
J2 = 690368191672: WR-MM Mini Module Connector, Female, THT, with Latch & Polarization, Angled, pitch 2.54mm, 16p; Manufacturer: Wurth Elektronik; Contact Resistance: 10mΩ; Insulation Resistance: 1000MΩ; Rated Current: 1.5A; Working Voltage: 250VAC; Withstanding Voltage: 500VAC; ComponentLink1Description: Website Link; ComponentLink1URL: https://www.we-online.com/redexpert/article/690368191672?ad; ComponentLink2Description: Datasheet Link; ComponentLink2URL: https://www.we-online.com/redexpert/spec/690368191672?ad; Manufacturer Part Number: 690368191672; Category: Board-to-Board Connectors; Match Code: WR-MM; Mount: Through Hole; Operating Temperature Max: 105°C; Operating Temperature Min: -40°C; Packaging: Tube; Length: 24.92mm; Gender: Female; Number of Pins: 16; Orientation: Angled; Pitch: 2.54mm
M1 = TEC-1091: Peltier control module
P1 = CMP-1502-01076-1: THT Vertical Pin Header WR-PHD, Pitch 2.54 mm, Single Row, 8 pins; Manufacturer: Wurth Elektronik; Rated Current: 3A; Pin Number: 8; Working Voltage: 250VAC; Gender: Male; Contact Resistance: 20mOhm; Pitch: 2.54mm; Withstanding Voltage: 500VAC; Publisher: WurthElektronik; Operating Temperature: -40to105degC; Orientation: Vertical; Row Number: Single; Part Number: 61300811121; Package Reference: 61300811121; Mounting Technology: THT; Packaging: Bag; Manufacturer URL: http://www.we-online.de; Datasheet URL: https://katalog.we-online.de/em/datasheet/6130xx11121.pdf
P3 P4 P7 = CMP-1712-00002-4: THT Vertical Pin Header WR-PHD, Pitch 2.54 mm, Single Row, 2 pins; Manufacturer: Wurth Elektronik; Rated Current: 3A; Gender: Male; Withstanding Voltage: 500VAC; Working Voltage: 250VAC; Pitch: 2.54mm; Contact Resistance: 20mOhm; Pin Number: 2; Mounting Technology: THT; Orientation: Vertical; Operating Temperature: -40to105degC; Packaging: Bag; Publisher: WurthElektronik; Datasheet URL: https://katalog.we-online.de/em/datasheet/6130xx11121.pdf; Manufacturer URL: http://www.we-online.de; Row Number: Single; Package Reference: 61300211121; Part Number: 61300211121
R4-R8 = R: Resistor - generic SMD
U2 = STM32G474QET6: No Description Available; Mfr_Name: STMicroelectronics; RefDes: RefDes; Type: Type
U3 = CMP-04916-000061-1: 650-NA QUIESCENT CURRENT, 12-PPM, 3V out
Y1 = CMP-2000-05730-2: Crystal 8MHz ±10ppm 10pF SMD-4 5mm x 3.2mm; Series Resistance: 200R; Load Capacitance: 10pF; Max Operating Temperature: 60°C; Frequency: 8MHz; Height - Seated (Max): 0.043inch; Frequency Tolerance: 10ppm; Packaging: Tape and Reel; Lead Free: Lead Free; Case/Package: SMD/SMT; Series: ABM3B; Min Operating Temperature: -10°C; REACH SVHC: No SVHC; Length: 0.197inch; RoHS Compliant: Yes; Depth: 3.2mm; Height: 0.043inch; Number of Pins: 4; Mount: Surface Mount; Frequency Stability: 10ppm; Width: 0.126inch; ESR (Equivalent Series Resistance): 200R

## Sheet V1_pwr_sply_noNegSply_sch.SchDoc
size A3; SheetNumber: 3; SheetTotal: 5; SPICEModelCacheNPPRCHHU: <root> / <DocumentId>NPPRCHHU</DocumentId> / <CacheFrame Number="0"> / <Model Name="875115552001_68uf" Kind="CKT"> / <Text>******* / .subckt 875115552001_68uF 1 2 / Rser 1 3 0.0109015046691 / Lser 2 4 4.507783507E-09 / C1 3 4 0.000068 / Rpar 3 4 73529.4117647059 / .ends 875115552001_68uF</Text> / </Model> / <Model Name="0805_885012107018_4.7uf" Kind="CKT"> / <Text>******* / .subckt 0805_885012107018_4.7uF 1 2 / Rser 1 3 0.00349429730952 / Lser 2 4 2.52123218E-10 / C1 3 4 0.0000047 / Rpar 3 4 20000000 / .ends 0805_885012107018_4.7uF</Text> / </Model> / <Model Name="6060_74439346100_10u" Kind="CKT"> / <Text>******* / .subckt 6060_74439346100_10u 1 2 / Rp 1 2 9786 / Cp 1 2 8.192p / Rs 1 N3 0.0265 / L1 N3 2 9.539u / .ends 6060_74439346100_10u</Text> / </Model> / </CacheFrame> / </root>
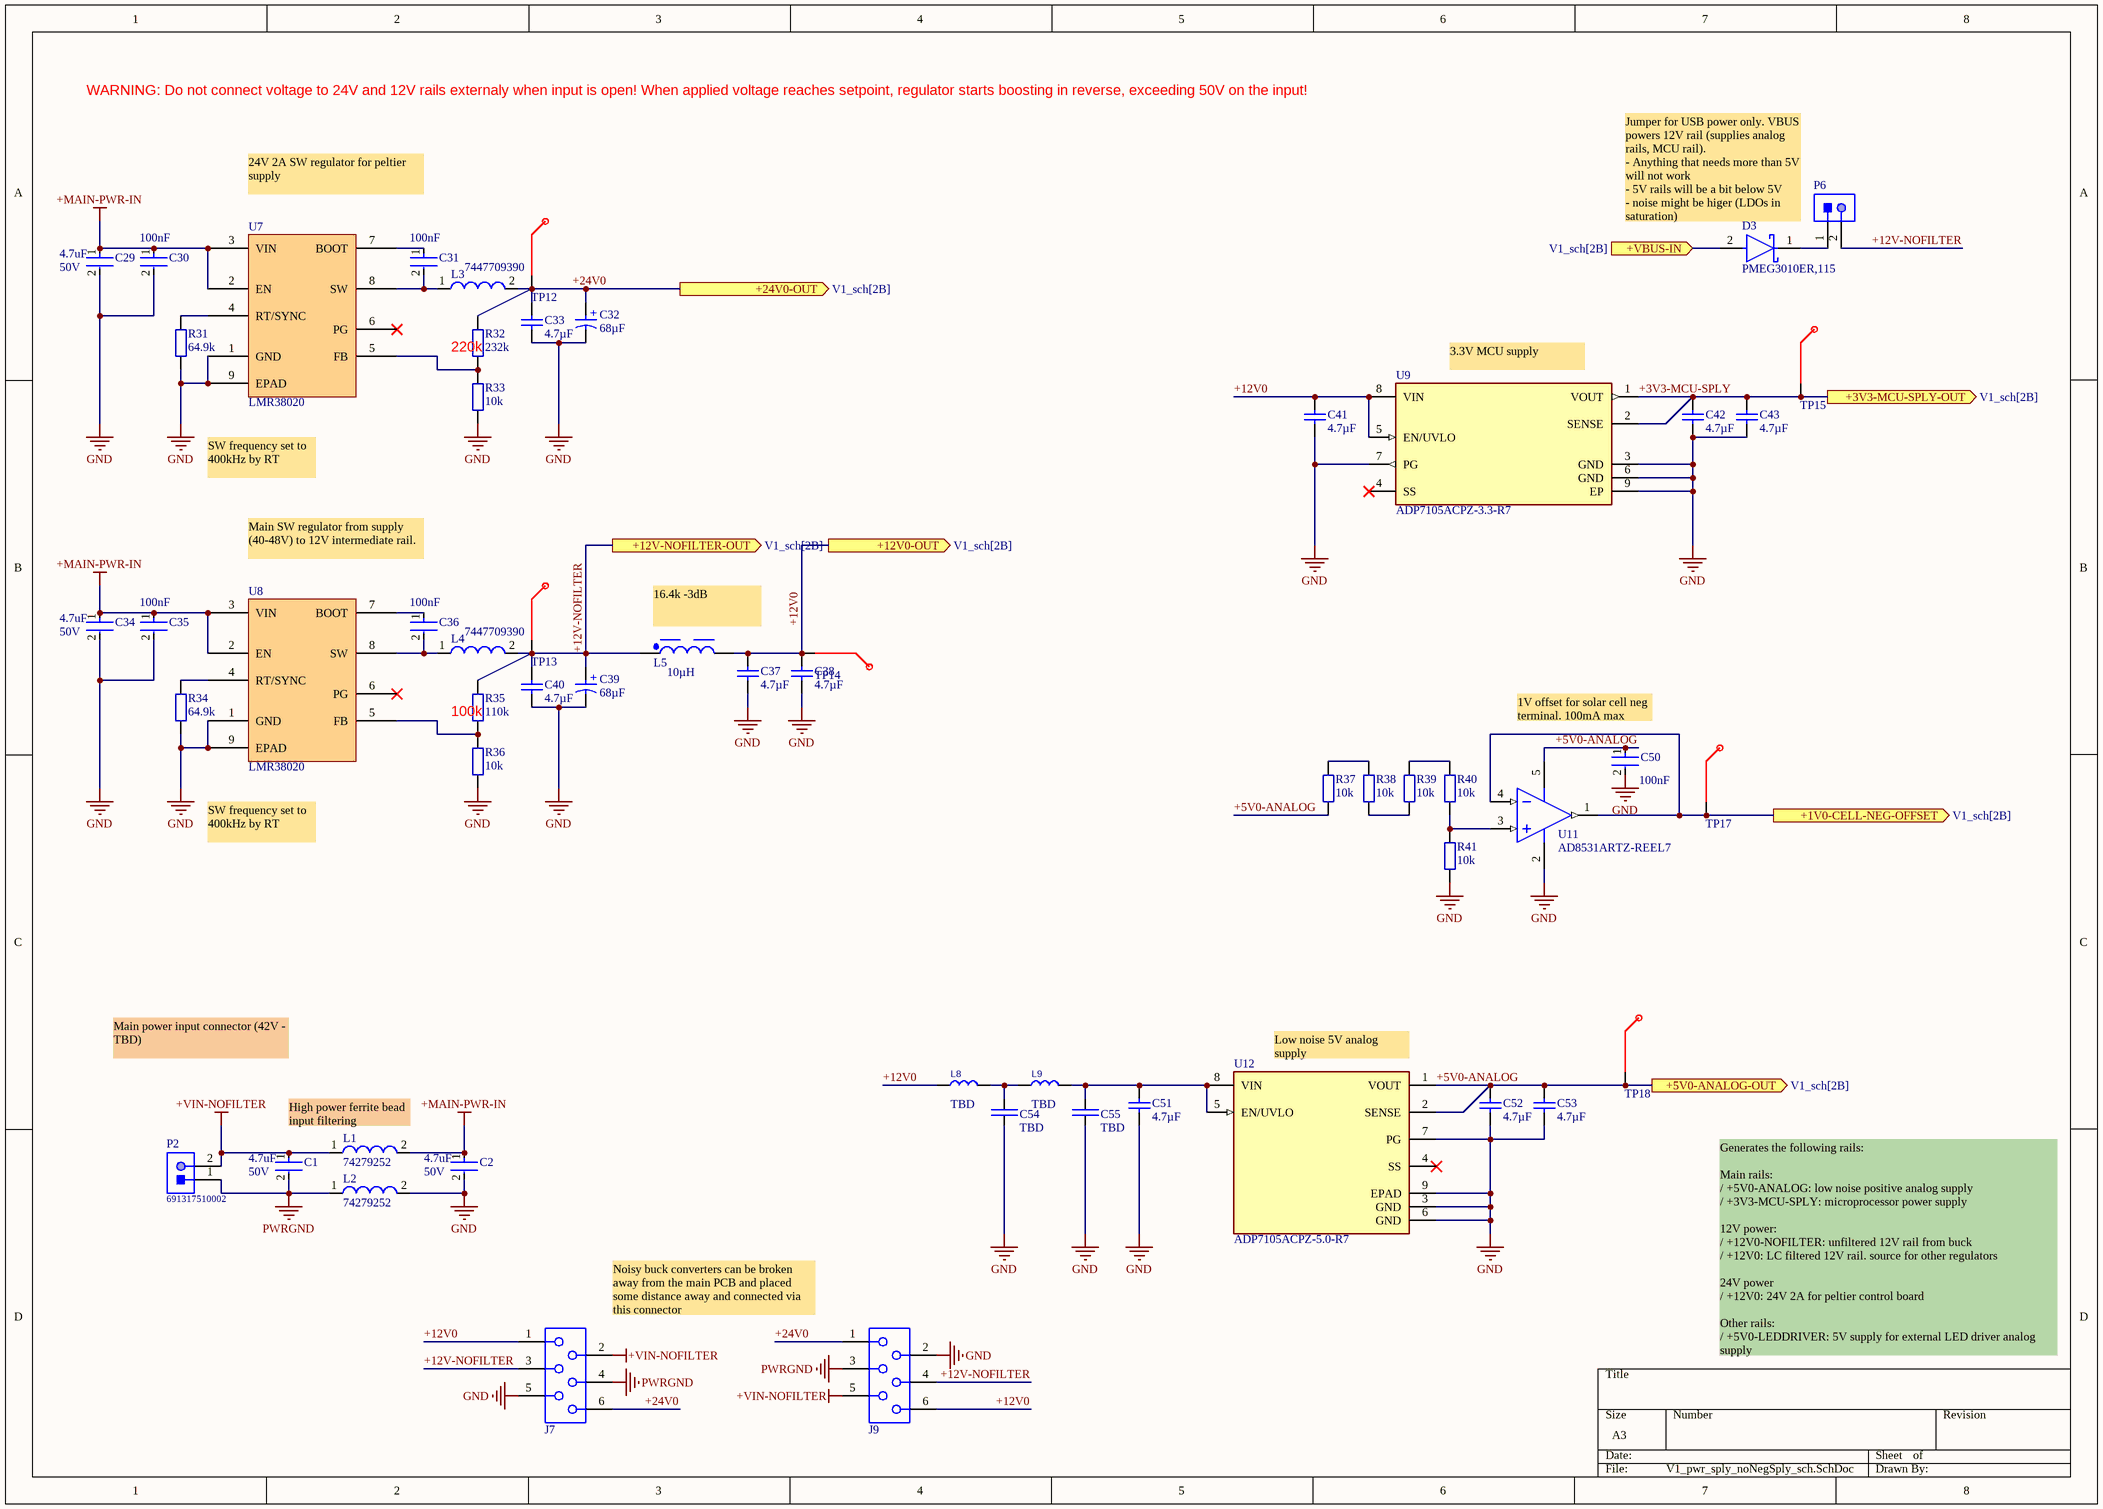
[diagram p4: V1_pwr_sply_noNegSply_sch.SchDoc]

### Parts
C1  Voltage Rating (DC): 50V  Capacitance: 4.7uF  [FP-885012208094-IPC_B]  (hidden comment: 885012208094)
C2  Voltage Rating (DC): 50V  Capacitance: 4.7uF  [FP-885012208094-IPC_B]  (hidden comment: 885012208094)
C29  Voltage Rating (DC): 50V  Capacitance: 4.7uF  [FP-885012208094-IPC_B]  (hidden comment: 885012208094)
C30  Capacitance: 100nF  [FP-885012206095-IPC_B]  (hidden comment: 885012206095)
C31  Capacitance: 100nF  [FP-885012206095-IPC_B]  (hidden comment: 885012206095)
C32  Capacitance: 68µF  [WCAP-PSHP_D8H8.7]  (hidden comment: 875115552001)
C33  Capacitance: 4.7µF  [WCAP-CSGP_0805_L2W1.25H1.25]  (hidden comment: 885012107018)
C34  Voltage Rating (DC): 50V  Capacitance: 4.7uF  [FP-885012208094-IPC_B]  (hidden comment: 885012208094)
C35  Capacitance: 100nF  [FP-885012206095-IPC_B]  (hidden comment: 885012206095)
C36  Capacitance: 100nF  [FP-885012206095-IPC_B]  (hidden comment: 885012206095)
C37  Capacitance: 4.7µF  [WCAP-CSGP_0805_L2W1.25H1.25]  (hidden comment: 885012107018)
C38  Capacitance: 4.7µF  [WCAP-CSGP_0805_L2W1.25H1.25]  (hidden comment: 885012107018)
C39  Capacitance: 68µF  [WCAP-PSHP_D8H8.7]  (hidden comment: 875115552001)
C40  Capacitance: 4.7µF  [WCAP-CSGP_0805_L2W1.25H1.25]  (hidden comment: 885012107018)
C41  Capacitance: 4.7µF  [WCAP-CSGP_0805_L2W1.25H1.25]  (hidden comment: 885012107018)
C42  Capacitance: 4.7µF  [WCAP-CSGP_0805_L2W1.25H1.25]  (hidden comment: 885012107018)
C43  Capacitance: 4.7µF  [WCAP-CSGP_0805_L2W1.25H1.25]  (hidden comment: 885012107018)
C50  Capacitance: 100nF  [FP-885012206095-IPC_B]  (hidden comment: 885012206095)
C51  Capacitance: 4.7µF  [WCAP-CSGP_0805_L2W1.25H1.25]  (hidden comment: 885012107018)
C52  Capacitance: 4.7µF  [WCAP-CSGP_0805_L2W1.25H1.25]  (hidden comment: 885012107018)
C53  Capacitance: 4.7µF  [WCAP-CSGP_0805_L2W1.25H1.25]  (hidden comment: 885012107018)
C54  value TBD  [FPR_0603_C_R0]  (hidden comment: PN_C0603_TBD)
C55  value TBD  [FPR_0603_C_R0]  (hidden comment: PN_C0603_TBD)
D3  PMEG3010ER,115  [FP-SOD123W-MFG]
J7  690368190672  [690368190672]  (value not drawn)
J9  690368190672  [690368190672]  (value not drawn)
L1  74279252  [SMD-1812]
L2  74279252  [SMD-1812]
L3  7447709390  [WE-PD-XXL]
L4  7447709390  [WE-PD-XXL]
L5  Inductance: 10µH  [WE-XHMI_6060_L6.65W6.45H5.8]  (hidden comment: 74439346100)
L8  value TBD  [FPR_1216_R_R0]  (hidden comment: L-TBD)
L9  value TBD  [FPR_1216_R_R0]  (hidden comment: L-TBD)
P2  691317510002  [691317510002]
P6  61300211121  [61300211121]  (value not drawn)
R31  value 64.9k  [FPR_0603_R_R0]  (hidden comment: PN_R0603_64k9)
R32  value 232k  [FPR_0603_R_R0]  (hidden comment: PN_R0603_232k)
R33  value 10k  [FPR_0603_R_R0]  (hidden comment: PN_R0603_10k)
R34  value 64.9k  [FPR_0603_R_R0]  (hidden comment: PN_R0603_64k9)
R35  value 110k  [FPR_0603_R_R0]  (hidden comment: PN_R0603_110k)
R36  value 10k  [FPR_0603_R_R0]  (hidden comment: PN_R0603_10k)
R37  value 10k  [FPR_0603_R_R0]  (hidden comment: PN_R0603_10k)
R38  value 10k  [FPR_0603_R_R0]  (hidden comment: PN_R0603_10k)
R39  value 10k  [FPR_0603_R_R0]  (hidden comment: PN_R0603_10k)
R40  value 10k  [FPR_0603_R_R0]  (hidden comment: PN_R0603_10k)
R41  value 10k  [FPR_0603_R_R0]  (hidden comment: PN_R0603_10k)
TP12  Test Point  [Test Point 1.5mm SMD]  (value not drawn)
TP13  Test Point  [Test Point 1.5mm SMD]  (value not drawn)
TP14  Test Point  [Test Point 1.5mm SMD]  (value not drawn)
TP15  Test Point  [Test Point 1.5mm SMD]  (value not drawn)
TP17  Test Point  [Test Point 1.5mm SMD]  (value not drawn)
TP18  Test Point  [Test Point 1.5mm SMD]  (value not drawn)
U7  LMR38020  [LMR38020-footprint]
U8  LMR38020  [LMR38020-footprint]
U9  ADP7105ACPZ-3.3-R7  [FP-CP-8-5-IPC_C]
U11  AD8531ARTZ-REEL7  [ADI-RJ-5_M]
U12  ADP7105ACPZ-5.0-R7  [FP-CP-8-5-IPC_C]

### Ports
+1V0-CELL-NEG-OFFSET (out, see V1_sch[2B]), +3V3-MCU-SPLY-OUT (out, see V1_sch[2B]), +5V0-ANALOG-OUT (out, see V1_sch[2B]), +12V0-OUT (out, see V1_sch[2B]), +12V-NOFILTER-OUT (out, see V1_sch[2B]), +24V0-OUT (out, see V1_sch[2B]), +VBUS-IN (in, see V1_sch[2B])

### Nets
+3V3-MCU-SPLY: C42.2 C43.2 TP15.1 U9.1(VOUT) U9.2(SENSE) ; port +3V3-MCU-SPLY-OUT
+5V0-ANALOG: C50.1 C52.2 C53.2 R37.1 TP18.1 U11.5(+V) U12.1(VOUT) U12.2(SENSE) ; port +5V0-ANALOG-OUT
+12V0: C37.2 C38.2 C41.2 J7.1 J9.6 L5.2 L8.1 TP14.1 U9.5(EN/UVLO) U9.8(VIN) ; port +12V0-OUT
+12V-NOFILTER: C39.1(P) C40.2 J7.3 J9.4 L4.2 L5.1 P6.2 R35.2 TP13.1 ; port +12V-NOFILTER-OUT
+24V0: C32.1(P) C33.2 J7.6 J9.1 L3.2 R32.2 TP12.1 ; port +24V0-OUT
+MAIN-PWR-IN: C2.1 C29.1 C30.1 C34.1 C35.1 L1.2 U7.2(EN) U7.3(VIN) U8.2(EN) U8.3(VIN)
+VBUS: D3.2(A) ; port +VBUS-IN
+VIN-NOFILTER: C1.1 J7.2 J9.5 L1.1 P2.2
DUT-BB12: TP17.1 U11.1(OUT_A) U11.4(-IN_A) ; port +1V0-CELL-NEG-OFFSET
GND: C2.2 C29.2 C30.2 C32.2(N) C33.1 C34.2 C35.2 C37.1 C38.1 C39.2(N) C40.1 C41.1 C42.1 C43.1 C50.2 C51.1 C52.1 C53.1 C54.1 C55.1 J7.5 J9.2 L2.2 R31.1 R33.1 R34.1 R36.1 R41.1 U7.1(GND) U7.9(EPAD) U8.1(GND) U8.9(EPAD) U9.3(GND) U9.6(GND) U9.7(PG) U9.9(EP) U11.2(-V) U12.3(GND) U12.6(GND) U12.7(PG) U12.9(EPAD)
PWRGND: C1.2 J7.4 J9.3 L2.1 P2.1
NetC31_1: C31.1 U7.7(BOOT)
NetC31_2: C31.2 L3.1 U7.8(SW)
NetC36_1: C36.1 U8.7(BOOT)
NetC36_2: C36.2 L4.1 U8.8(SW)
NetC51_2: C51.2 C55.2 L9.2 U12.5(EN/UVLO) U12.8(VIN)
NetC54_2: C54.2 L8.2 L9.1
NetD3_1: D3.1(C) P6.1
NetR31_2: R31.2 U7.4(RT/SYNC)
NetR32_1: R32.1 R33.2 U7.5(FB)
NetR34_2: R34.2 U8.4(RT/SYNC)
NetR35_1: R35.1 R36.2 U8.5(FB)
NetR37_2: R37.2 R38.2
NetR38_1: R38.1 R39.1
NetR39_2: R39.2 R40.2
NetR40_1: R40.1 R41.2 U11.3(+IN_A)

Not connected (* = marked no-connect by the designer): U7 6(PG)*; U8 6(PG)*; U9 4(SS)*; U12 4(SS)*

### Notes on the sheet
- WARNING: Do not connect voltage to 24V and 12V rails externaly when input is open! When applied voltage reaches setpoint, regulator starts boosting in reverse, exceeding 50V on the input!
- 24V 2A SW regulator for peltier supply
- Jumper for USB power only. VBUS powers 12V rail (supplies analog rails, MCU rail).
  - Anything that needs more than 5V will not work
  - 5V rails will be a bit below 5V
  - noise might be higer (LDOs in saturation)
- (near R32) 220k
- (near U9) 3.3V MCU supply
- SW frequency set to 400kHz by RT
- Main SW regulator from supply (40-48V) to 12V intermediate rail.
- 16.4k -3dB
- (near R35) 100k
- (near C50) 1V offset for solar cell neg terminal. 100mA max
- Main power input connector (42V - TBD)
- (near U12) Low noise 5V analog supply
- High power ferrite bead input filtering
- Noisy buck converters can be broken away from the main PCB and placed some distance away and connected via this connector
- Generates the following rails:
  Main rails:
  / +5V0-ANALOG: low noise positive analog supply
  / +3V3-MCU-SPLY: microprocessor power supply
  12V power:
  / +12V0-NOFILTER: unfiltered 12V rail from buck
  / +12V0: LC filtered 12V rail. source for other regulators
  24V power
  / +12V0: 24V 2A for peltier control board
  Other rails:
  / +5V0-LEDDRIVER: 5V supply for external LED driver analog supply
  / +1V0-CELL-NEG-OFFSET: offset for solar cell neg termianls
- (in symbol 875115552001) +

### Library data of the parts
C1 C2 C29 C34 = CMP-207839-000019-1: CAP CER 4.7UF 50V X7R 1206; Tolerance: 10%; Mount: Surface Mount; Width: 0.063inch; Min Operating Temperature: -55°C; RoHS Compliant: Yes; Dielectric: X7R; Series: WCAP-CSGP; Case Code (Metric): 3216; Case/Package: 1206; Max Operating Temperature: 125°C; Thickness: 0.075inch; Packaging: Cut Tape; Length: 0.126inch; Voltage Rating: 50V; Case Code (Imperial): 1206
C30 C31 C35 C36 C50 = CMP-207839-000004-1: as C3 on sheet V1_sch; RoHS Compliant: Yes; Thickness: 0.037inch; Voltage Rating: 50V; Packaging: Cut Tape; Dielectric: X7R; Series: WCAP-CSGP; Width: 0.031inch; Max Operating Temperature: 125°C; Min Operating Temperature: -55°C; Case/Package: 0603; Case Code (Metric): 1608; Case Code (Imperial): 0603; Length: 0.063inch; Mount: Surface Mount; Voltage Rating (DC): 50V
C32 C39 = 875115552001: WCAP-PSHP Aluminum Polymer Capacitor, V-Chip, SMT, D8 x H8.7mm, 68µF, 25V; Manufacturer: Wurth Elektronik; Capacitance Tolerance: +/-20%; Dissipation Factor: 8%; Endurance: 2000h; ESR: 20mΩ; Leakage Current: 340µA; Ripple Current: 3500mA; Technical Reference: PSEE087680M025DVCTEB000; Manufacturer Part Number: 875115552001; Category: Aluminum Polymer Capacitors; Match Code: WCAP-PSHP; ComponentLink1Description: Website Link; ComponentLink1URL: https://www.we-online.com/redexpert/article/875115552001?ad; ComponentLink2Description: Datasheet Link; ComponentLink2URL: https://www.we-online.com/redexpert/spec/875115552001?ad; Mount: Surface Mount; Operating Temperature Max: 105°C; Operating Temperature Min: -55°C; Packaging: Tape and Reel; Height: 8.7mm; Diameter: 8mm; Rated Voltage (DC): 25V
C33 C37 C38 C40-C43 C51-C53 = 885012107018: as C11 on sheet V1_sch; Manufacturer Part Number: 885012107018; Category: Multilayer Ceramic Chip Capacitors; Match Code: WCAP-CSGP; ComponentLink1Description: Website Link; ComponentLink1URL: https://www.we-online.com/redexpert/article/885012107018?ad; ComponentLink2Description: Datasheet Link; ComponentLink2URL: https://www.we-online.com/redexpert/spec/885012107018?ad; Mount: Surface Mount; Operating Temperature Max: 85°C; Operating Temperature Min: -55°C; Packaging: Tape and Reel; Length: 2mm; Width: 1.25mm; Height: 1.25mm; Ceramic Type: X5R
C54 C55 = C: Capacitor - generic SMD
D3 = CMP-14398-000036-1: DIODE SCHOTTKY 30V 1A CFP3; RoHS Compliant: Yes
J7 J9 = 690368190672: WR-MM Mini Module Connector, Female, THT, with Latch & Polarization, Angled, pitch 2.54mm, 6p; Manufacturer: Wurth Elektronik; Contact Resistance: 10mΩ; Insulation Resistance: 1000MΩ; Rated Current: 1.5A; Working Voltage: 250VAC; Withstanding Voltage: 500VAC; ComponentLink1Description: Website Link; ComponentLink1URL: https://www.we-online.com/redexpert/article/690368190672?ad; ComponentLink2Description: Datasheet Link; ComponentLink2URL: https://www.we-online.com/redexpert/spec/690368190672?ad; Manufacturer Part Number: 690368190672; Category: Board-to-Board Connectors; Match Code: WR-MM; Mount: Through Hole; Operating Temperature Max: 105°C; Operating Temperature Min: -40°C; Packaging: Tube; Length: 12.22mm; Gender: Female; Number of Pins: 6; Orientation: Angled; Pitch: 2.54mm
L1 L2 = CMP-0220-00090-1: SMD EMI Suppression Ferrite Bead WE-CBF, Z = 680 Ohm; Impedance: 680 Ohm; ComponentLink1Description: Manufacturer Link; ComponentLink2URL: http://www.we-online.de/katalog/media/pdf/74279252.pdf; PackageReference: SMD-1812; PackageVersion: 2010; PackageDescription: Chip Inductor, 2-Leads, Body 4.5 x 3.2 mm; ComponentLink1URL: http://www.we-online.com; ComponentLink2Description: Datasheet; DatasheetVersion: ver 7, May-2010
L3 L4 = CMP-0227-00184-1: SMD-Shielded Power Inductor WE-PD, L = 39.0 µH; Inductance: 39.0 ÂµH; ComponentLink2Description: Datasheet; PackageDescription: SMD Inductor, 2-Leads, Body 12.0 x 12.0 mm; PackageVersion: 2004; ComponentLink2URL: http://www.we-online.de/katalog/media/pdf/7447709390.pdf; DatasheetVersion: ver 2, Jun-2006; ComponentLink1URL: http://www.we-online.com; ComponentLink1Description: Manufacturer Link; PackageReference: WE-PD-XXL
L5 = 74439346100: WE-XHMI SMT Power Inductor, size 6060, 10µH, 5A, 26.5mΩ; Manufacturer: Wurth Elektronik; Case/Size Code: 6060; Performance Rated Current: 6.4A; Saturation Current: 9.7A; Self Resonant Frequency: 18MHz; Manufacturer Part Number: 74439346100; Category: Shielded Power Inductors; Match Code: WE-XHMI; ComponentLink1Description: Website Link; ComponentLink1URL: https://www.we-online.com/redexpert/article/74439346100?ad; ComponentLink2Description: Datasheet Link; ComponentLink2URL: https://www.we-online.com/redexpert/spec/74439346100?ad; Mount: Surface Mount; Operating Temperature Max: 125°C; Operating Temperature Min: -40°C; Packaging: Tape and Reel; Length: 6.65mm; Width: 6.45mm; Height: 5.8mm; DC Resistance: 26.5mΩ; Rated Current: 5A
L8 L9 = L: Inductor - generic SMD
P2 = CMP-1502-02238-1: Serie 3175 - 5.08mm Close Horizontal PCB Header with Flages WR-TBL, 2 pin; Manufacturer: Wurth Elektronik; Pin Number: 2; Gender: Male; Pitch: 5.08mm; Publisher: WurthElektronik; Part Number: 691317510002; Manufacturer URL: http://www.we-online.de; Package Reference: 691317510002; Mounting Technology: THT; Datasheet URL: http://katalog.we-online.de/em/datasheet/6913175100xx.pdf; Operating Temperature: -40to105degC; Packaging: Box
P6 = CMP-1712-00002-4: as P3 on sheet V1_sch; Mounting Technology: THT; Orientation: Vertical; Operating Temperature: -40to105degC; Packaging: Bag; Publisher: WurthElektronik; Datasheet URL: https://katalog.we-online.de/em/datasheet/6130xx11121.pdf; Manufacturer URL: http://www.we-online.de; Row Number: Single; Package Reference: 61300211121; Part Number: 61300211121
R31-R41 = R: Resistor - generic SMD
U7 U8 = LMR38020: LMR38020 SIMPLE SWITCHER® 4.2-V to 80-V, 2-A Synchronous Buck Converter with 40-µA IQ
U9 = CMP-09138-000177-1: IC REG LINEAR 3.3V 500MA 8LFCSP; Max Input Voltage: 20V; Max Output Voltage: 19V; Power Supply Rejection Ratio (PSRR): 50dB; Max Supply Current: 900uA; Min Output Voltage: 1.22V; Max Operating Temperature: 125°C; Min Operating Temperature: -40°C; RoHS Compliant: Yes; Min Input Voltage: 3.3V; Max Output Current: 500mA; Number of Pins: 8
U11 = CMP-0384-01486-1: Single Channel RRIO Operational Amplifier, 3 MHz BW, 5 V/us SR, Industrial, 5-pin SOT23 (RJ-5), Reel; Manufacturer: Analog Devices; Generic Part Number: AD8531; Input Bias Current: 5pA; Iq/Amp: 1.25mA; Amplifiers Per Package: 1; V Span Min: 2.7V; Slew Rate: 5V/us; V Span Max: 6V; Input Offset Voltage: 25mV; Small Signal Bandwidth: 3MHz; ComponentLink3Description: Package Specification; ComponentLink1URL: http://www.analog.com/en/index.html; DatasheetVersion: Rev. F; ComponentLink3URL: http://www.analog.com/static/imported-files/packages/PKG_PDF/SOT-23(RJ)/RJ_5.pdf; ComponentLink2URL: http://www.analog.com/static/imported-files/data_sheets/AD8531_8532_8534.pdf; ComponentLink2Description: Datasheet; ComponentLink1Description: Manufacturer URL; Code_JEDEC: MO-178-AA; PackageReference: RJ-5; PartNumber: AD8531ARTZ-REEL7; PackageDescription: 5-Pin Small Outline Transistor Package, Body 2.9 x 1.6 mm, Pitch 0.95 mm; Packing: Reel; Mounting Technology: Surface Mount; PackageVersion: 121608-A
U12 = CMP-09138-000117-1: IC REG LINEAR 5V 500MA 8LFCSP; Polarity: Positive; Power Supply Rejection Ratio (PSRR): 50dB; Min Output Voltage: 1.22V; Quiescent Current: 900uA; Number of Regulators: 1; Min Input Voltage: 3.3V; Dropout Voltage: 350mV; Min Current Limit: 625mA; Max Input Voltage: 20V; Reference Voltage: 1.23V; Operating Supply Current: 900mA; Max Output Voltage: 19V; Output Type: Fixed; Accuracy: 0.8%; Output Current: 500mA; Max Output Current: 500mA; Number of Outputs: 1; Max Supply Current: 900uA; Number of Pins: 8; Output Voltage: 5V; Package Quantity: 1500; RoHS Compliant: Yes; Lead Free: Contains Lead; Packaging: Tape and Reel; Max Operating Temperature: 125°C; Mount: Surface Mount; Min Operating Temperature: -40°C; Contact Plating: Tin

## Sheet V1_USB_sch.SchDoc
size A4; SheetNumber: 4; SheetTotal: 5; SPICEModelCacheQUAUZBGH: <root> / <DocumentId>QUAUZBGH</DocumentId> / <CacheFrame Number="0"> / <Model Name="0805_885012107018_4.7uf" Kind="CKT"> / <Text>******* / .subckt 0805_885012107018_4.7uF 1 2 / Rser 1 3 0.00349429730952 / Lser 2 4 2.52123218E-10 / C1 3 4 0.0000047 / Rpar 3 4 20000000 / .ends 0805_885012107018_4.7uF</Text> / </Model> / </CacheFrame> / </root>
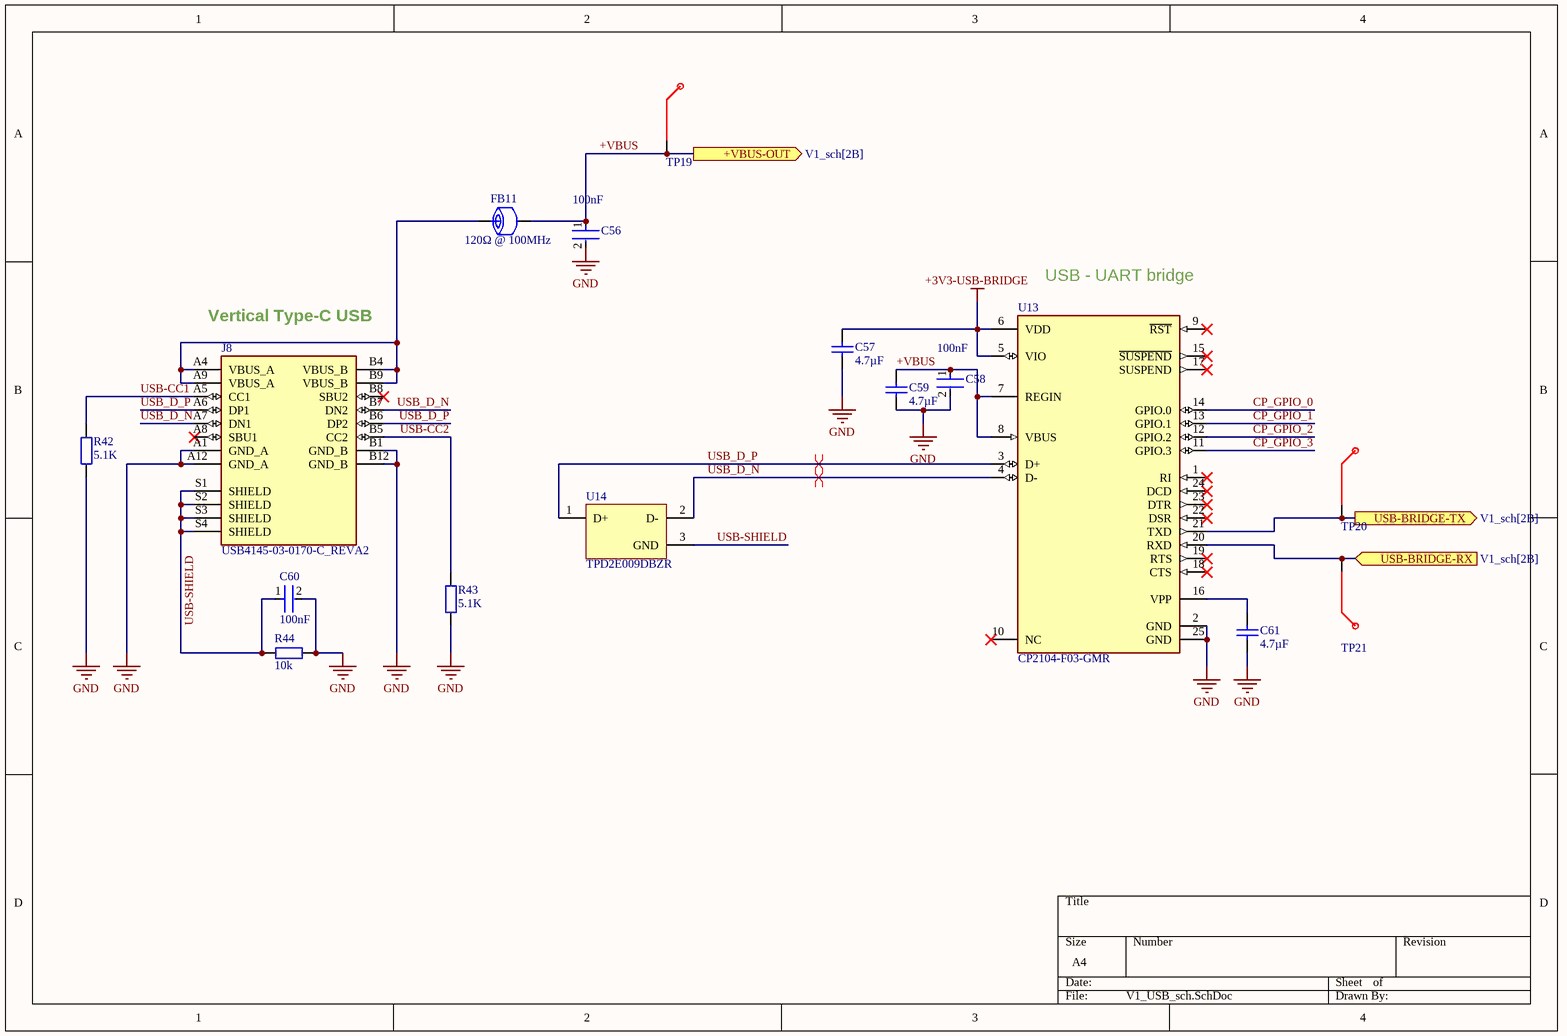
[diagram p5: V1_USB_sch.SchDoc]

### Parts
C56  Capacitance: 100nF  [FP-885012206095-IPC_B]  (hidden comment: 885012206095)
C57  Capacitance: 4.7µF  [WCAP-CSGP_0805_L2W1.25H1.25]  (hidden comment: 885012107018)
C58  Capacitance: 100nF  [FP-885012206095-IPC_B]  (hidden comment: 885012206095)
C59  Capacitance: 4.7µF  [WCAP-CSGP_0805_L2W1.25H1.25]  (hidden comment: 885012107018)
C60  Capacitance: 100nF  [FP-885012206095-IPC_B]  (hidden comment: 885012206095)
C61  Capacitance: 4.7µF  [WCAP-CSGP_0805_L2W1.25H1.25]  (hidden comment: 885012107018)
FB11  120Ω @ 100MHz  [SMD_0805]
J8  USB4145-03-0170-C_REVA2  [GCT_USB4145-03-0170-C_REVA2]
R42  value 5.1K  [FPR_0603_R_R0]  (hidden comment: PN_R0603_5k1)
R43  value 5.1K  [FPR_0603_R_R0]  (hidden comment: PN_R0603_5k1)
R44  value 10k  [FPR_0603_R_R0]  (hidden comment: PN_R0603_10k)
TP19  Test Point  [Test Point 1.5mm SMD]  (value not drawn)
TP20  Test Point  [Test Point 1.5mm SMD]  (value not drawn)
TP21  Test Point  [Test Point 1.5mm SMD]  (value not drawn)
U13  CP2104-F03-GMR  [FP-CP2104-F03-GMR-IPC_A]
U14  TPD2E009DBZR  [DBZ0003A_L]

### Ports
+VBUS-OUT (out, see V1_sch[2B]), USB-BRIDGE-RX (in, see V1_sch[2B]), USB-BRIDGE-TX (out, see V1_sch[2B])

### Nets
+3V3-USB-BRIDGE: C57.2 U13.5(VIO) U13.6(VDD)
+VBUS: C56.1 C58.1 C59.2 FB11.2 TP19.1 U13.7(REGIN) U13.8(VBUS) ; port +VBUS-OUT
GND: C56.2 C57.1 C58.2 C59.1 C60.2 C61.1 J8.A1(GND_A) J8.A12(GND_A) J8.B1(GND_B) J8.B12(GND_B) R42.2 R43.2 R44.1 U13.2(GND) U13.25(GND)
CP_GPIO_0: U13.14(GPIO.0)
CP_GPIO_1: U13.13(GPIO.1)
CP_GPIO_2: U13.12(GPIO.2)
CP_GPIO_3: U13.11(GPIO.3)
MCU-COMMS-RX: TP20.1 U13.21(TXD) ; port USB-BRIDGE-TX
MCU-COMMS-TX: TP21.1 U13.20(RXD) ; port USB-BRIDGE-RX
USB-CC1: J8.A5(CC1) R42.1
USB-CC2: J8.B5(CC2) R43.1
USB-SHIELD: C60.1 J8.S1(SHIELD) J8.S2(SHIELD) J8.S3(SHIELD) J8.S4(SHIELD) R44.2 U14.3(GND)
USB_D_N: J8.A7(DN1) J8.B7(DN2) U13.4(D-) U14.2(D-)
USB_D_P: J8.A6(DP1) J8.B6(DP2) U13.3(D+) U14.1(D+)
NetC61_2: C61.2 U13.16(VPP)
NetFB11_1: FB11.1 J8.A4(VBUS_A) J8.A9(VBUS_A) J8.B4(VBUS_B) J8.B9(VBUS_B)

Not connected (* = marked no-connect by the designer): J8 A8(SBU1)* B8(SBU2)*; U13 1(RI)* 9(~{RST})* 10(NC)* 15(~{SUSPEND})* 17(SUSPEND)* 18(CTS)* 19(RTS)* 22(DSR)* 23(DTR)* 24(DCD)*

### Layout directives
differential pair: USB_D_N, USB_D_P

### Notes on the sheet
- (near J8) Vertical Type-C USB
- (near U13) USB - UART bridge

### Library data of the parts
C56 C58 C60 = CMP-207839-000004-1: as C3 on sheet V1_sch; RoHS Compliant: Yes; Thickness: 0.037inch; Voltage Rating: 50V; Packaging: Cut Tape; Dielectric: X7R; Series: WCAP-CSGP; Width: 0.031inch; Max Operating Temperature: 125°C; Min Operating Temperature: -55°C; Case/Package: 0603; Case Code (Metric): 1608; Case Code (Imperial): 0603; Length: 0.063inch; Mount: Surface Mount; Voltage Rating (DC): 50V
C57 C59 C61 = 885012107018: as C11 on sheet V1_sch; Manufacturer Part Number: 885012107018; Category: Multilayer Ceramic Chip Capacitors; Match Code: WCAP-CSGP; ComponentLink1Description: Website Link; ComponentLink1URL: https://www.we-online.com/redexpert/article/885012107018?ad; ComponentLink2Description: Datasheet Link; ComponentLink2URL: https://www.we-online.com/redexpert/spec/885012107018?ad; Mount: Surface Mount; Operating Temperature Max: 85°C; Operating Temperature Min: -55°C; Packaging: Tape and Reel; Length: 2mm; Width: 1.25mm; Height: 1.25mm; Ceramic Type: X5R
FB11 = BLM21AG121SN1D: as FB1 on sheet V1_sch; Category: ferite beads; Price: 0.082; Manufacturer Number: BLM21AG121SN1D; AC resistance: 120Ω; Frequency: 100MHz; Case: 0805; Technology: SMT; HelpURL: https://www.farnell.com/datasheets/1914683.pdf
R42-R44 = R: Resistor - generic SMD
U13 = CMP-08107-000004-1: IC SGL USB-TO-UART BRIDGE 24QFN; Manufacturer: Silicon Laboratories; Max Supply Voltage: 3.6V; Min Supply Voltage: 1.8V; Nominal Supply Current: 100-17000uA; Standoff Height: 0mm; Interface: UART,USB; Temperature Range Low: -40°C; Lead Free: Yes; Device Class L3: Controllers; Ambient Temperature Range Low: -55°C; Automotive: No; Category: IC; Temperature: -40°C to +85°C; Octopart: https://octopart.com/cp2104-f03-gmr-silicon+labs-19668642; Ambient Temperature Range High: +125°C; Package: CP2104-F03-GMR; Device Class L2: Interface ICs; Digikey Description: IC SGL USB-TO-UART BRIDGE 24QFN; Device Class L1: Integrated Circuits (ICs); Manufacturer Part Number: CP2104-F03-GMR; Temperature Range High: +85°C; ComponentLink2URL: https://www.silabs.com/documents/public/data-sheets/cp2104.pdf; Height: 0.8mm; Ipc Land Pattern Name: QFN50P400X400X75-24; Mouser Description: I/O Controller Interface IC USB to UART bridge; ComponentLink2Description: Datasheet; RoHS: TRUE; LCSC: C47742
U14 = CMP-0326-00068-3: ESD Protection Array for High-Speed Data Interfaces, 2 Channels, -40 to +85 degC, 3-pin SOT-23 (DBZ), Green (RoHS & no Sb/Br); Manufacturer: Texas Instruments; IO Leakage Current(nA): 10; IEC 61000-4-2 Air-Gap(+/- kV): 8; Differential Capacitance(pF): 0.01; Breakdown Voltage(Min)(V): 9; Serial ATA / eSATA: TRUE; SubFamily: ESD Solution; IO Capacitance(Typ)(pF): 0.7; DatasheetVersion: SLVS953A; PackageVersion: revB, Apr-2005; PackageDescription: 3-Pin Plastic Small-Outline Package, 0.95 mm Pitch, 2.4 mm Lead Span; IEC 61000-4-2 Contact(+/- kV): 8; ComponentLink3Description: URL Link1; ComponentLink2Description: Datasheet; ComponentLink3URL: SamplesURL:http://www.ti.com/product/tpd2e009#samples; ComponentLink1Description: Manufacturer URL; PartNumber: TPD2E009DBZR; Eco-Plan: Green (RoHS & no Sb/Br); ComponentLink1URL: http://www.ti.com/; ComponentLink2URL: http://www.ti.com/general/docs/lit/getliterature.tsp?genericPartNumber=TPD2E009&fileType=pdf; Mounting Technology: Surface Mount; PackageReference: DBZ0003A
J8 = USB4145-03-0170-C_REVA2: Price: None; Value: *; Package: None; Availability: Unavailable; MP: USB4145-03-0170-C_REVA2